# EAGLE schematic MasterPCB_transfer (EAGLE 9.6.2), part 1 of 3

## Sheet 1 of 12: Strain Gauge ADC
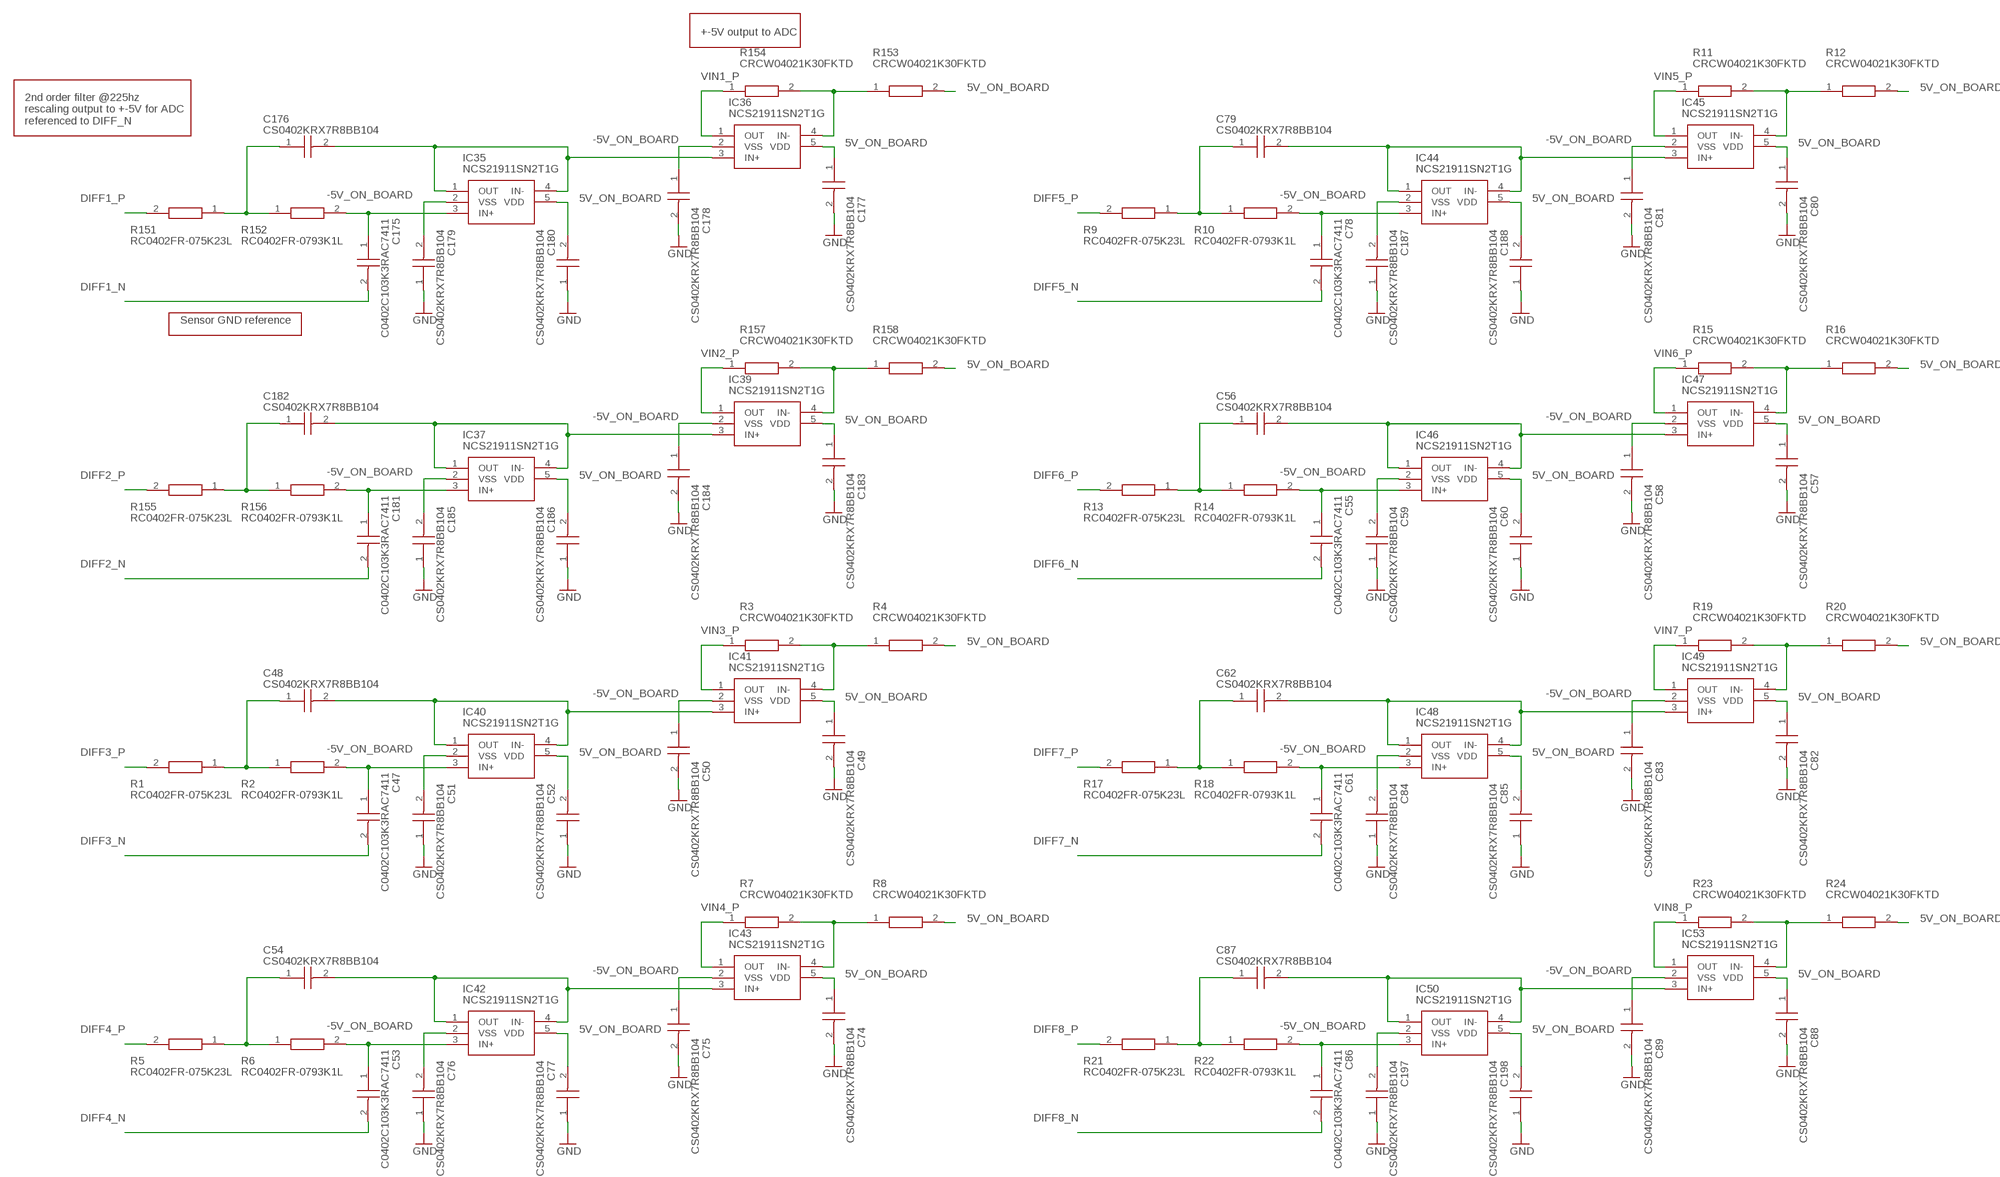
[diagram p0: schematic, sheet 1, part 1 of 3]
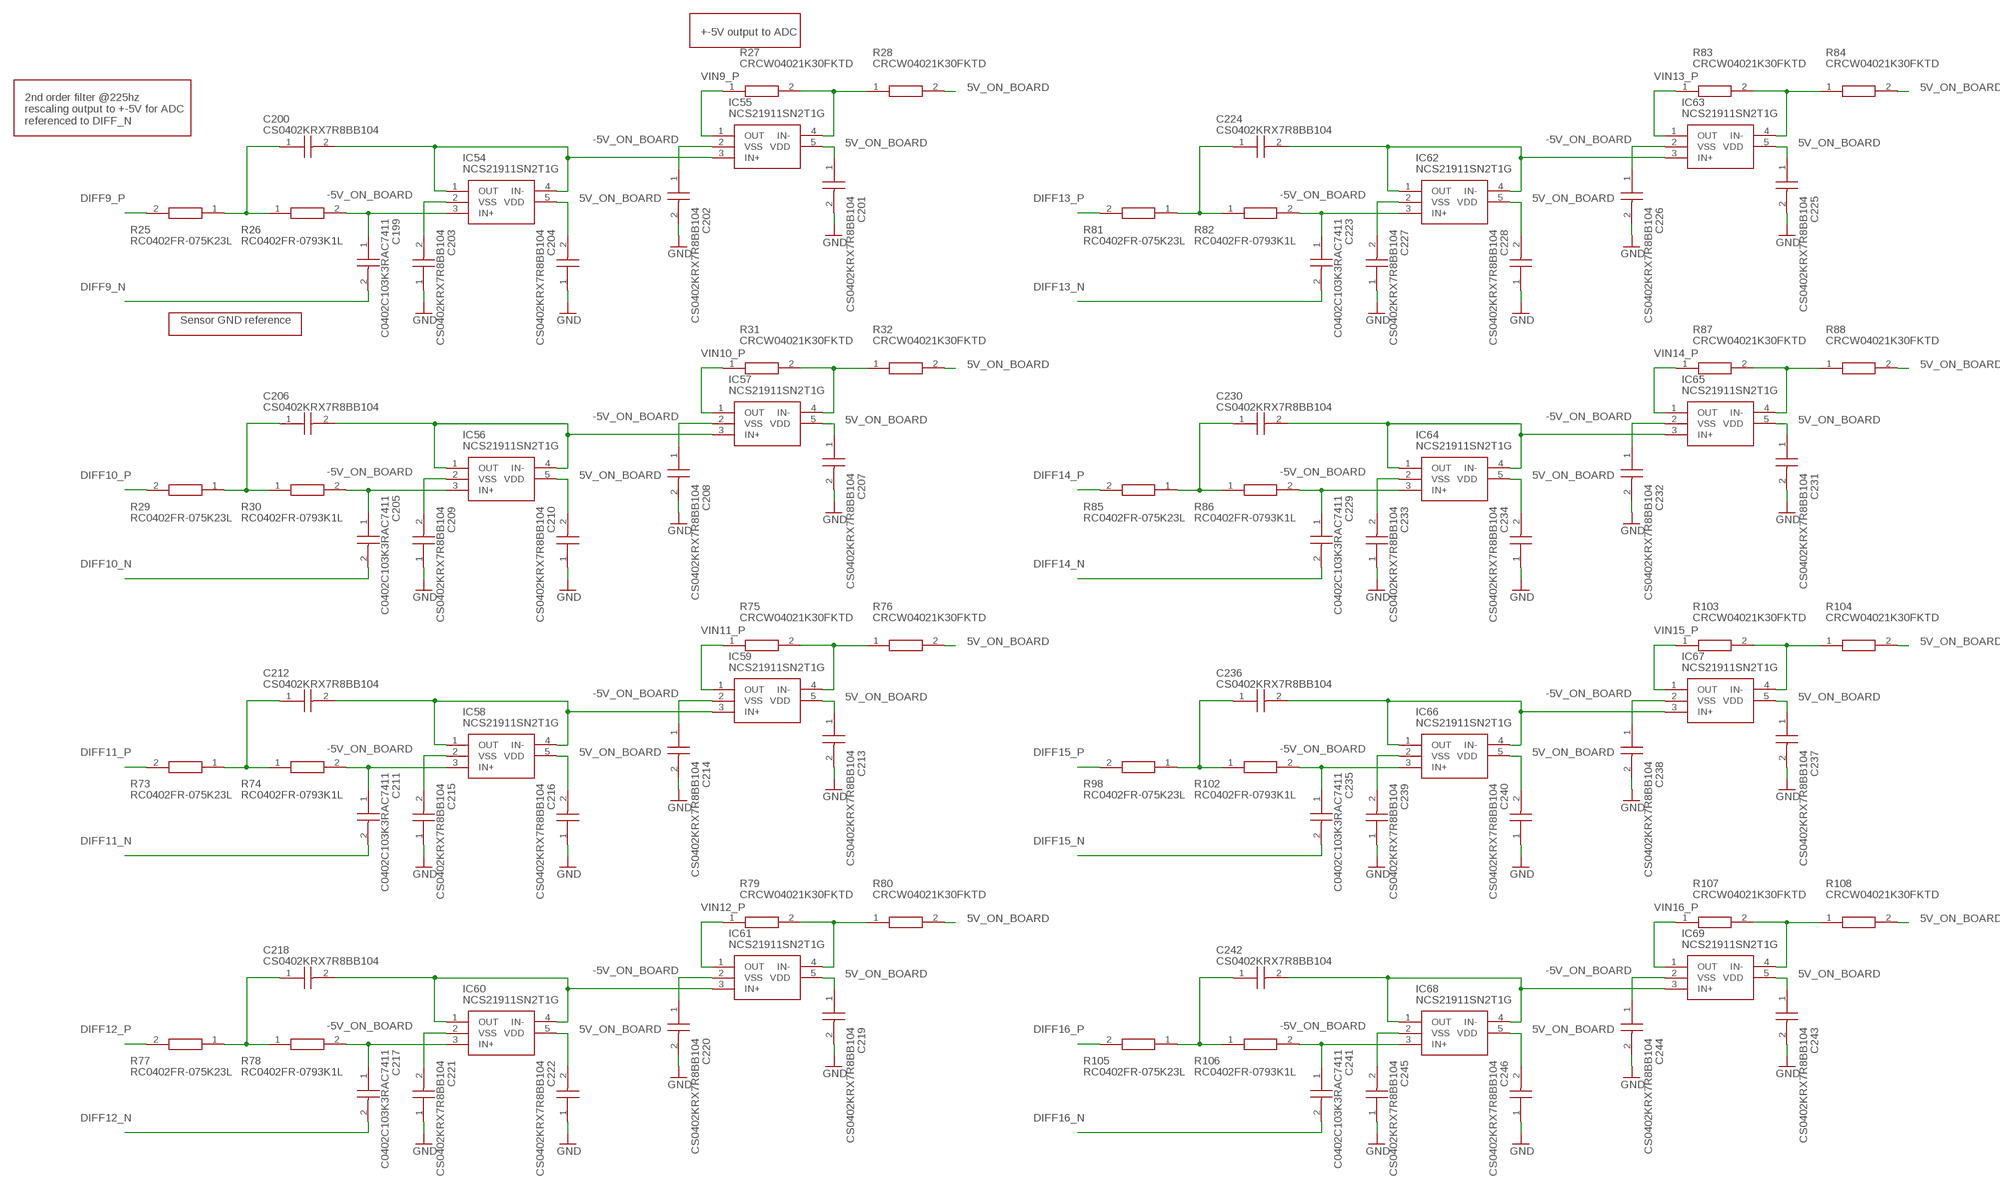
[diagram p1: schematic, sheet 1, part 2 of 3]
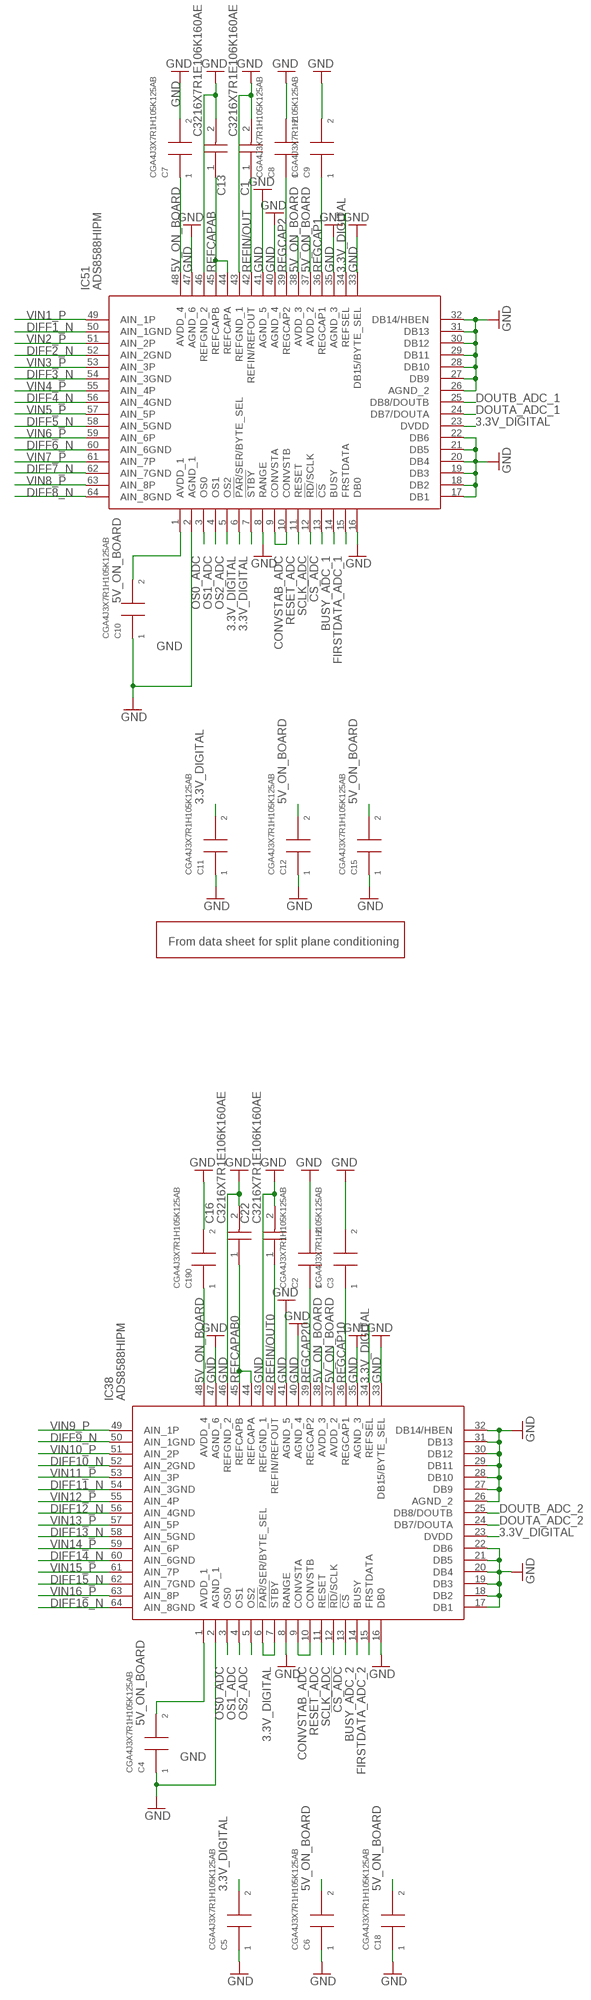
[diagram p2: schematic, sheet 1, part 3 of 3]

### Parts
C1  C3216X7R1E106K160AE  [C3216_COMMERCIAL]
C2  CGA4J3X7R1H105K125AB  [CAPC2012X145N]
C3  CGA4J3X7R1H105K125AB  [CAPC2012X145N]
C4  CGA4J3X7R1H105K125AB  [CAPC2012X145N]
C5  CGA4J3X7R1H105K125AB  [CAPC2012X145N]
C6  CGA4J3X7R1H105K125AB  [CAPC2012X145N]
C7  CGA4J3X7R1H105K125AB  [CAPC2012X145N]
C8  CGA4J3X7R1H105K125AB  [CAPC2012X145N]
C9  CGA4J3X7R1H105K125AB  [CAPC2012X145N]
C10  CGA4J3X7R1H105K125AB  [CAPC2012X145N]
C11  CGA4J3X7R1H105K125AB  [CAPC2012X145N]
C12  CGA4J3X7R1H105K125AB  [CAPC2012X145N]
C13  C3216X7R1E106K160AE  [C3216_COMMERCIAL]
C15  CGA4J3X7R1H105K125AB  [CAPC2012X145N]
C16  C3216X7R1E106K160AE  [C3216_COMMERCIAL]
C18  CGA4J3X7R1H105K125AB  [CAPC2012X145N]
C22  C3216X7R1E106K160AE  [C3216_COMMERCIAL]
C47  C0402C103K3RAC7411  [C0402]
C48  CS0402KRX7R8BB104  [CAPC1005X65N]
C49  CS0402KRX7R8BB104  [CAPC1005X65N]
C50  CS0402KRX7R8BB104  [CAPC1005X65N]
C51  CS0402KRX7R8BB104  [CAPC1005X65N]
C52  CS0402KRX7R8BB104  [CAPC1005X65N]
C53  C0402C103K3RAC7411  [C0402]
C54  CS0402KRX7R8BB104  [CAPC1005X65N]
C55  C0402C103K3RAC7411  [C0402]
C56  CS0402KRX7R8BB104  [CAPC1005X65N]
C57  CS0402KRX7R8BB104  [CAPC1005X65N]
C58  CS0402KRX7R8BB104  [CAPC1005X65N]
C59  CS0402KRX7R8BB104  [CAPC1005X65N]
C60  CS0402KRX7R8BB104  [CAPC1005X65N]
C61  C0402C103K3RAC7411  [C0402]
C62  CS0402KRX7R8BB104  [CAPC1005X65N]
C74  CS0402KRX7R8BB104  [CAPC1005X65N]
C75  CS0402KRX7R8BB104  [CAPC1005X65N]
C76  CS0402KRX7R8BB104  [CAPC1005X65N]
C77  CS0402KRX7R8BB104  [CAPC1005X65N]
C78  C0402C103K3RAC7411  [C0402]
C79  CS0402KRX7R8BB104  [CAPC1005X65N]
C80  CS0402KRX7R8BB104  [CAPC1005X65N]
C81  CS0402KRX7R8BB104  [CAPC1005X65N]
C82  CS0402KRX7R8BB104  [CAPC1005X65N]
C83  CS0402KRX7R8BB104  [CAPC1005X65N]
C84  CS0402KRX7R8BB104  [CAPC1005X65N]
C85  CS0402KRX7R8BB104  [CAPC1005X65N]
C86  C0402C103K3RAC7411  [C0402]
C87  CS0402KRX7R8BB104  [CAPC1005X65N]
C88  CS0402KRX7R8BB104  [CAPC1005X65N]
C89  CS0402KRX7R8BB104  [CAPC1005X65N]
C175  C0402C103K3RAC7411  [C0402]
C176  CS0402KRX7R8BB104  [CAPC1005X65N]
C177  CS0402KRX7R8BB104  [CAPC1005X65N]
C178  CS0402KRX7R8BB104  [CAPC1005X65N]
C179  CS0402KRX7R8BB104  [CAPC1005X65N]
C180  CS0402KRX7R8BB104  [CAPC1005X65N]
C181  C0402C103K3RAC7411  [C0402]
C182  CS0402KRX7R8BB104  [CAPC1005X65N]
C183  CS0402KRX7R8BB104  [CAPC1005X65N]
C184  CS0402KRX7R8BB104  [CAPC1005X65N]
C185  CS0402KRX7R8BB104  [CAPC1005X65N]
C186  CS0402KRX7R8BB104  [CAPC1005X65N]
C187  CS0402KRX7R8BB104  [CAPC1005X65N]
C188  CS0402KRX7R8BB104  [CAPC1005X65N]
C190  CGA4J3X7R1H105K125AB  [CAPC2012X145N]
C197  CS0402KRX7R8BB104  [CAPC1005X65N]
C198  CS0402KRX7R8BB104  [CAPC1005X65N]
C199  C0402C103K3RAC7411  [C0402]
C200  CS0402KRX7R8BB104  [CAPC1005X65N]
C201  CS0402KRX7R8BB104  [CAPC1005X65N]
C202  CS0402KRX7R8BB104  [CAPC1005X65N]
C203  CS0402KRX7R8BB104  [CAPC1005X65N]
C204  CS0402KRX7R8BB104  [CAPC1005X65N]
C205  C0402C103K3RAC7411  [C0402]
C206  CS0402KRX7R8BB104  [CAPC1005X65N]
C207  CS0402KRX7R8BB104  [CAPC1005X65N]
C208  CS0402KRX7R8BB104  [CAPC1005X65N]
C209  CS0402KRX7R8BB104  [CAPC1005X65N]
C210  CS0402KRX7R8BB104  [CAPC1005X65N]
C211  C0402C103K3RAC7411  [C0402]
C212  CS0402KRX7R8BB104  [CAPC1005X65N]
C213  CS0402KRX7R8BB104  [CAPC1005X65N]
C214  CS0402KRX7R8BB104  [CAPC1005X65N]
C215  CS0402KRX7R8BB104  [CAPC1005X65N]
C216  CS0402KRX7R8BB104  [CAPC1005X65N]
C217  C0402C103K3RAC7411  [C0402]
C218  CS0402KRX7R8BB104  [CAPC1005X65N]
C219  CS0402KRX7R8BB104  [CAPC1005X65N]
C220  CS0402KRX7R8BB104  [CAPC1005X65N]
C221  CS0402KRX7R8BB104  [CAPC1005X65N]
C222  CS0402KRX7R8BB104  [CAPC1005X65N]
C223  C0402C103K3RAC7411  [C0402]
C224  CS0402KRX7R8BB104  [CAPC1005X65N]
C225  CS0402KRX7R8BB104  [CAPC1005X65N]
C226  CS0402KRX7R8BB104  [CAPC1005X65N]
C227  CS0402KRX7R8BB104  [CAPC1005X65N]
C228  CS0402KRX7R8BB104  [CAPC1005X65N]
C229  C0402C103K3RAC7411  [C0402]
C230  CS0402KRX7R8BB104  [CAPC1005X65N]
C231  CS0402KRX7R8BB104  [CAPC1005X65N]
C232  CS0402KRX7R8BB104  [CAPC1005X65N]
C233  CS0402KRX7R8BB104  [CAPC1005X65N]
C234  CS0402KRX7R8BB104  [CAPC1005X65N]
C235  C0402C103K3RAC7411  [C0402]
C236  CS0402KRX7R8BB104  [CAPC1005X65N]
C237  CS0402KRX7R8BB104  [CAPC1005X65N]
C238  CS0402KRX7R8BB104  [CAPC1005X65N]
C239  CS0402KRX7R8BB104  [CAPC1005X65N]
C240  CS0402KRX7R8BB104  [CAPC1005X65N]
C241  C0402C103K3RAC7411  [C0402]
C242  CS0402KRX7R8BB104  [CAPC1005X65N]
C243  CS0402KRX7R8BB104  [CAPC1005X65N]
C244  CS0402KRX7R8BB104  [CAPC1005X65N]
C245  CS0402KRX7R8BB104  [CAPC1005X65N]
C246  CS0402KRX7R8BB104  [CAPC1005X65N]
IC35  NCS21911SN2T1G  [SOT95P275X110-5N]
IC36  NCS21911SN2T1G  [SOT95P275X110-5N]
IC37  NCS21911SN2T1G  [SOT95P275X110-5N]
IC38  ADS8588HIPM  [QFP50P1200X1200X160-64N_NO_3D]
IC39  NCS21911SN2T1G  [SOT95P275X110-5N]
IC40  NCS21911SN2T1G  [SOT95P275X110-5N]
IC41  NCS21911SN2T1G  [SOT95P275X110-5N]
IC42  NCS21911SN2T1G  [SOT95P275X110-5N]
IC43  NCS21911SN2T1G  [SOT95P275X110-5N]
IC44  NCS21911SN2T1G  [SOT95P275X110-5N]
IC45  NCS21911SN2T1G  [SOT95P275X110-5N]
IC46  NCS21911SN2T1G  [SOT95P275X110-5N]
IC47  NCS21911SN2T1G  [SOT95P275X110-5N]
IC48  NCS21911SN2T1G  [SOT95P275X110-5N]
IC49  NCS21911SN2T1G  [SOT95P275X110-5N]
IC50  NCS21911SN2T1G  [SOT95P275X110-5N]
IC51  ADS8588HIPM  [QFP50P1200X1200X160-64N_NO_3D]
IC53  NCS21911SN2T1G  [SOT95P275X110-5N]
IC54  NCS21911SN2T1G  [SOT95P275X110-5N]
IC55  NCS21911SN2T1G  [SOT95P275X110-5N]
IC56  NCS21911SN2T1G  [SOT95P275X110-5N]
IC57  NCS21911SN2T1G  [SOT95P275X110-5N]
IC58  NCS21911SN2T1G  [SOT95P275X110-5N]
IC59  NCS21911SN2T1G  [SOT95P275X110-5N]
IC60  NCS21911SN2T1G  [SOT95P275X110-5N]
IC61  NCS21911SN2T1G  [SOT95P275X110-5N]
IC62  NCS21911SN2T1G  [SOT95P275X110-5N]
IC63  NCS21911SN2T1G  [SOT95P275X110-5N]
IC64  NCS21911SN2T1G  [SOT95P275X110-5N]
IC65  NCS21911SN2T1G  [SOT95P275X110-5N]
IC66  NCS21911SN2T1G  [SOT95P275X110-5N]
IC67  NCS21911SN2T1G  [SOT95P275X110-5N]
IC68  NCS21911SN2T1G  [SOT95P275X110-5N]
IC69  NCS21911SN2T1G  [SOT95P275X110-5N]
R1  RC0402FR-075K23L  [RESC1005X40N]
R2  RC0402FR-0793K1L  [RESC1005X40N]
R3  CRCW04021K30FKTD  [RESC1005X40N]
R4  CRCW04021K30FKTD  [RESC1005X40N]
R5  RC0402FR-075K23L  [RESC1005X40N]
R6  RC0402FR-0793K1L  [RESC1005X40N]
R7  CRCW04021K30FKTD  [RESC1005X40N]
R8  CRCW04021K30FKTD  [RESC1005X40N]
R9  RC0402FR-075K23L  [RESC1005X40N]
R10  RC0402FR-0793K1L  [RESC1005X40N]
R11  CRCW04021K30FKTD  [RESC1005X40N]
R12  CRCW04021K30FKTD  [RESC1005X40N]
R13  RC0402FR-075K23L  [RESC1005X40N]
R14  RC0402FR-0793K1L  [RESC1005X40N]
R15  CRCW04021K30FKTD  [RESC1005X40N]
R16  CRCW04021K30FKTD  [RESC1005X40N]
R17  RC0402FR-075K23L  [RESC1005X40N]
R18  RC0402FR-0793K1L  [RESC1005X40N]
R19  CRCW04021K30FKTD  [RESC1005X40N]
R20  CRCW04021K30FKTD  [RESC1005X40N]
R21  RC0402FR-075K23L  [RESC1005X40N]
R22  RC0402FR-0793K1L  [RESC1005X40N]
R23  CRCW04021K30FKTD  [RESC1005X40N]
R24  CRCW04021K30FKTD  [RESC1005X40N]
R25  RC0402FR-075K23L  [RESC1005X40N]
R26  RC0402FR-0793K1L  [RESC1005X40N]
R27  CRCW04021K30FKTD  [RESC1005X40N]
R28  CRCW04021K30FKTD  [RESC1005X40N]
R29  RC0402FR-075K23L  [RESC1005X40N]
R30  RC0402FR-0793K1L  [RESC1005X40N]
R31  CRCW04021K30FKTD  [RESC1005X40N]
R32  CRCW04021K30FKTD  [RESC1005X40N]
R73  RC0402FR-075K23L  [RESC1005X40N]
R74  RC0402FR-0793K1L  [RESC1005X40N]
R75  CRCW04021K30FKTD  [RESC1005X40N]
R76  CRCW04021K30FKTD  [RESC1005X40N]
R77  RC0402FR-075K23L  [RESC1005X40N]
R78  RC0402FR-0793K1L  [RESC1005X40N]
R79  CRCW04021K30FKTD  [RESC1005X40N]
R80  CRCW04021K30FKTD  [RESC1005X40N]
R81  RC0402FR-075K23L  [RESC1005X40N]
R82  RC0402FR-0793K1L  [RESC1005X40N]
R83  CRCW04021K30FKTD  [RESC1005X40N]
R84  CRCW04021K30FKTD  [RESC1005X40N]
R85  RC0402FR-075K23L  [RESC1005X40N]
R86  RC0402FR-0793K1L  [RESC1005X40N]
R87  CRCW04021K30FKTD  [RESC1005X40N]
R88  CRCW04021K30FKTD  [RESC1005X40N]
R98  RC0402FR-075K23L  [RESC1005X40N]
R102  RC0402FR-0793K1L  [RESC1005X40N]
R103  CRCW04021K30FKTD  [RESC1005X40N]
R104  CRCW04021K30FKTD  [RESC1005X40N]
R105  RC0402FR-075K23L  [RESC1005X40N]
R106  RC0402FR-0793K1L  [RESC1005X40N]
R107  CRCW04021K30FKTD  [RESC1005X40N]
R108  CRCW04021K30FKTD  [RESC1005X40N]
R151  RC0402FR-075K23L  [RESC1005X40N]
R152  RC0402FR-0793K1L  [RESC1005X40N]
R153  CRCW04021K30FKTD  [RESC1005X40N]
R154  CRCW04021K30FKTD  [RESC1005X40N]
R155  RC0402FR-075K23L  [RESC1005X40N]
R156  RC0402FR-0793K1L  [RESC1005X40N]
R157  CRCW04021K30FKTD  [RESC1005X40N]
R158  CRCW04021K30FKTD  [RESC1005X40N]

### Nets
3.3V_DIGITAL: C5.2 C11.2 IC38.6(!PAR!/SER/BYTE_SEL) IC38.7(!STBY) IC38.23(DVDD) IC38.34(REFSEL) IC51.6(!PAR!/SER/BYTE_SEL) IC51.7(!STBY) IC51.23(DVDD) IC51.34(REFSEL) ; also sheet 2,4,9,10,11
5V_ON_BOARD: C4.2 C6.2 C7.1 C10.2 C12.2 C15.2 C18.2 C49.1 C52.2 C57.1 C60.2 C74.1 C77.2 C80.1 C82.1 C85.2 C88.1 C177.1 C180.2 C183.1 C186.2 C188.2 C190.1 C198.2 C201.1 C204.2 C207.1 C210.2 C213.1 C216.2 C219.1 C222.2 C225.1 C228.2 C231.1 C234.2 C237.1 C240.2 C243.1 C246.2 IC35.5(VDD) IC36.5(VDD) IC37.5(VDD) IC38.1(AVDD_1) IC38.37(AVDD_2) IC38.38(AVDD_3) IC38.48(AVDD_4) IC39.5(VDD) IC40.5(VDD) IC41.5(VDD) IC42.5(VDD) IC43.5(VDD) IC44.5(VDD) IC45.5(VDD) IC46.5(VDD) IC47.5(VDD) IC48.5(VDD) IC49.5(VDD) IC50.5(VDD) IC51.1(AVDD_1) IC51.37(AVDD_2) IC51.38(AVDD_3) IC51.48(AVDD_4) IC53.5(VDD) IC54.5(VDD) IC55.5(VDD) IC56.5(VDD) IC57.5(VDD) IC58.5(VDD) IC59.5(VDD) IC60.5(VDD) IC61.5(VDD) IC62.5(VDD) IC63.5(VDD) IC64.5(VDD) IC65.5(VDD) IC66.5(VDD) IC67.5(VDD) IC68.5(VDD) IC69.5(VDD) R4.2 R8.2 R12.2 R16.2 R20.2 R24.2 R28.2 R32.2 R76.2 R80.2 R84.2 R88.2 R104.2 R108.2 R153.2 R158.2 ; also sheet 2,4,6
!CS_ADC: IC38.13(!CS) IC51.13(!CS) ; also sheet 2,12
-5V_ON_BOARD: C50.1 C51.2 C58.1 C59.2 C75.1 C76.2 C81.1 C83.1 C84.2 C89.1 C178.1 C179.2 C184.1 C185.2 C187.2 C197.2 C202.1 C203.2 C208.1 C209.2 C214.1 C215.2 C220.1 C221.2 C226.1 C227.2 C232.1 C233.2 C238.1 C239.2 C244.1 C245.2 IC35.2(VSS) IC36.2(VSS) IC37.2(VSS) IC39.2(VSS) IC40.2(VSS) IC41.2(VSS) IC42.2(VSS) IC43.2(VSS) IC44.2(VSS) IC45.2(VSS) IC46.2(VSS) IC47.2(VSS) IC48.2(VSS) IC49.2(VSS) IC50.2(VSS) IC53.2(VSS) IC54.2(VSS) IC55.2(VSS) IC56.2(VSS) IC57.2(VSS) IC58.2(VSS) IC59.2(VSS) IC60.2(VSS) IC61.2(VSS) IC62.2(VSS) IC63.2(VSS) IC64.2(VSS) IC65.2(VSS) IC66.2(VSS) IC67.2(VSS) IC68.2(VSS) IC69.2(VSS) ; also sheet 2,4
BUSY_ADC_1: IC51.14(BUSY) ; also sheet 12
BUSY_ADC_2: IC38.14(BUSY) ; also sheet 12
CONVSTAB_ADC: IC38.9(CONVSTA) IC38.10(CONVSTB) IC51.9(CONVSTA) IC51.10(CONVSTB) ; also sheet 2,12
DIFF1_N: C175.2 IC51.50(AIN_1GND) ; also sheet 11
DIFF1_P: R151.2 ; also sheet 11
DIFF2_N: C181.2 IC51.52(AIN_2GND) ; also sheet 11
DIFF2_P: R155.2 ; also sheet 11
DIFF3_N: C47.2 IC51.54(AIN_3GND) ; also sheet 11
DIFF3_P: R1.2 ; also sheet 11
DIFF4_N: C53.2 IC51.56(AIN_4GND) ; also sheet 11
DIFF4_P: R5.2 ; also sheet 11
DIFF5_N: C78.2 IC51.58(AIN_5GND) ; also sheet 11
DIFF5_P: R9.2 ; also sheet 11
DIFF6_N: C55.2 IC51.60(AIN_6GND) ; also sheet 11
DIFF6_P: R13.2 ; also sheet 11
DIFF7_N: C61.2 IC51.62(AIN_7GND) ; also sheet 11
DIFF7_P: R17.2 ; also sheet 11
DIFF8_N: C86.2 IC51.64(AIN_8GND) ; also sheet 11
DIFF8_P: R21.2 ; also sheet 11
DIFF9_N: C199.2 IC38.50(AIN_1GND) ; also sheet 11
DIFF9_P: R25.2 ; also sheet 11
DIFF10_N: C205.2 IC38.52(AIN_2GND) ; also sheet 11
DIFF10_P: R29.2 ; also sheet 11
DIFF11_N: C211.2 IC38.54(AIN_3GND) ; also sheet 11
DIFF11_P: R73.2 ; also sheet 11
DIFF12_N: C217.2 IC38.56(AIN_4GND) ; also sheet 11
DIFF12_P: R77.2 ; also sheet 11
DIFF13_N: C223.2 IC38.58(AIN_5GND) ; also sheet 11
DIFF13_P: R81.2 ; also sheet 11
DIFF14_N: C229.2 IC38.60(AIN_6GND) ; also sheet 11
DIFF14_P: R85.2 ; also sheet 11
DIFF15_N: C235.2 IC38.62(AIN_7GND) ; also sheet 11
DIFF15_P: R98.2 ; also sheet 11
DIFF16_N: C241.2 IC38.64(AIN_8GND) ; also sheet 11
DIFF16_P: R105.2 ; also sheet 11
DOUTA_ADC_1: IC51.24(DB7/DOUTA) ; also sheet 12
DOUTA_ADC_2: IC38.24(DB7/DOUTA) ; also sheet 12
DOUTB_ADC_1: IC51.25(DB8/DOUTB) ; also sheet 12
DOUTB_ADC_2: IC38.25(DB8/DOUTB) ; also sheet 12
FIRSTDATA_ADC_1: IC51.15(FRSTDATA) ; also sheet 12
FIRSTDATA_ADC_2: IC38.15(FRSTDATA) ; also sheet 12
GND: C1.2 C2.2 C3.2 C4.1 C5.1 C6.1 C7.2 C8.2 C9.2 C10.1 C11.1 C12.1 C13.2 C15.1 C16.2 C18.1 C22.2 C49.2 C50.2 C51.1 C52.1 C57.2 C58.2 C59.1 C60.1 C74.2 C75.2 C76.1 C77.1 C80.2 C81.2 C82.2 C83.2 C84.1 C85.1 C88.2 C89.2 C177.2 C178.2 C179.1 C180.1 C183.2 C184.2 C185.1 C186.1 C187.1 C188.1 C190.2 C197.1 C198.1 C201.2 C202.2 C203.1 C204.1 C207.2 C208.2 C209.1 C210.1 C213.2 C214.2 C215.1 C216.1 C219.2 C220.2 C221.1 C222.1 C225.2 C226.2 C227.1 C228.1 C231.2 C232.2 C233.1 C234.1 C237.2 C238.2 C239.1 C240.1 C243.2 C244.2 C245.1 C246.1 IC38.2(AGND_1) IC38.8(RANGE) IC38.16(DB0) IC38.17(DB1) IC38.18(DB2) IC38.19(DB3) IC38.20(DB4) IC38.21(DB5) IC38.22(DB6) IC38.26(AGND_2) IC38.27(DB9) IC38.28(DB10) IC38.29(DB11) IC38.30(DB12) IC38.31(DB13) IC38.32(DB14/HBEN) IC38.33(DB15/BYTE_SEL) IC38.35(AGND_3) IC38.40(AGND_4) IC38.41(AGND_5) IC38.43(REFGND_1) IC38.46(REFGND_2) IC38.47(AGND_6) IC51.2(AGND_1) IC51.8(RANGE) IC51.16(DB0) IC51.17(DB1) IC51.18(DB2) IC51.19(DB3) IC51.20(DB4) IC51.21(DB5) IC51.22(DB6) IC51.26(AGND_2) IC51.27(DB9) IC51.28(DB10) IC51.29(DB11) IC51.30(DB12) IC51.31(DB13) IC51.32(DB14/HBEN) IC51.33(DB15/BYTE_SEL) IC51.35(AGND_3) IC51.40(AGND_4) IC51.41(AGND_5) IC51.43(REFGND_1) IC51.46(REFGND_2) IC51.47(AGND_6) ; also sheet 2,3,4,5,6,7,8,9,10,11,12
N$6: C48.1 R1.1 R2.1
N$7: C47.1 IC40.3(IN+) R2.2
N$17: IC41.4(IN-) R3.2 R4.1
N$18: C48.2 IC40.1(OUT) IC40.4(IN-) IC41.3(IN+)
N$80: C182.1 R155.1 R156.1
N$86: C54.1 R5.1 R6.1
N$87: C53.1 IC42.3(IN+) R6.2
N$88: IC43.4(IN-) R7.2 R8.1
N$89: C54.2 IC42.1(OUT) IC42.4(IN-) IC43.3(IN+)
N$90: C79.1 R9.1 R10.1
N$91: C78.1 IC44.3(IN+) R10.2
N$92: IC45.4(IN-) R11.2 R12.1
N$93: C79.2 IC44.1(OUT) IC44.4(IN-) IC45.3(IN+)
N$94: C56.1 R13.1 R14.1
N$95: C55.1 IC46.3(IN+) R14.2
N$96: IC47.4(IN-) R15.2 R16.1
N$97: C56.2 IC46.1(OUT) IC46.4(IN-) IC47.3(IN+)
N$98: C62.1 R17.1 R18.1
N$99: C61.1 IC48.3(IN+) R18.2
N$100: IC49.4(IN-) R19.2 R20.1
N$101: C62.2 IC48.1(OUT) IC48.4(IN-) IC49.3(IN+)
N$102: C87.1 R21.1 R22.1
N$103: C86.1 IC50.3(IN+) R22.2
N$104: IC53.4(IN-) R23.2 R24.1
N$105: C87.2 IC50.1(OUT) IC50.4(IN-) IC53.3(IN+)
N$106: C200.1 R25.1 R26.1
N$107: C199.1 IC54.3(IN+) R26.2
N$108: IC55.4(IN-) R27.2 R28.1
N$109: C200.2 IC54.1(OUT) IC54.4(IN-) IC55.3(IN+)
N$110: C206.1 R29.1 R30.1
N$114: C176.2 IC35.1(OUT) IC35.4(IN-) IC36.3(IN+)
N$119: C176.1 R151.1 R152.1
N$130: C175.1 IC35.3(IN+) R152.2
N$132: IC36.4(IN-) R153.1 R154.2
N$133: C181.1 IC37.3(IN+) R156.2
N$136: IC39.4(IN-) R157.2 R158.1
N$139: C182.2 IC37.1(OUT) IC37.4(IN-) IC39.3(IN+)
N$141: C205.1 IC56.3(IN+) R30.2
N$142: IC57.4(IN-) R31.2 R32.1
N$144: C206.2 IC56.1(OUT) IC56.4(IN-) IC57.3(IN+)
N$145: C212.1 R73.1 R74.1
N$166: C211.1 IC58.3(IN+) R74.2
N$170: IC59.4(IN-) R75.2 R76.1
N$171: C212.2 IC58.1(OUT) IC58.4(IN-) IC59.3(IN+)
N$179: C218.1 R77.1 R78.1
N$180: C217.1 IC60.3(IN+) R78.2
N$190: IC61.4(IN-) R79.2 R80.1
N$200: C218.2 IC60.1(OUT) IC60.4(IN-) IC61.3(IN+)
N$210: C224.1 R81.1 R82.1
N$214: C223.1 IC62.3(IN+) R82.2
N$220: IC63.4(IN-) R83.2 R84.1
N$230: C224.2 IC62.1(OUT) IC62.4(IN-) IC63.3(IN+)
N$233: C230.1 R85.1 R86.1
N$234: C229.1 IC64.3(IN+) R86.2
N$240: IC65.4(IN-) R87.2 R88.1
N$249: C230.2 IC64.1(OUT) IC64.4(IN-) IC65.3(IN+)
N$250: C236.1 R98.1 R102.1
N$251: C235.1 IC66.3(IN+) R102.2
N$252: IC67.4(IN-) R103.2 R104.1
N$260: C236.2 IC66.1(OUT) IC66.4(IN-) IC67.3(IN+)
N$267: C242.1 R105.1 R106.1
N$269: C241.1 IC68.3(IN+) R106.2
N$283: IC69.4(IN-) R107.2 R108.1
N$285: C242.2 IC68.1(OUT) IC68.4(IN-) IC69.3(IN+)
OS0_ADC: IC38.3(OS0) IC51.3(OS0) ; also sheet 2,12
OS1_ADC: IC38.4(OS1) IC51.4(OS1) ; also sheet 2,12
OS2_ADC: IC38.5(OS2) IC51.5(OS2) ; also sheet 2,12
REFCAPAB: C13.1 IC51.44(REFCAPA) IC51.45(REFCAPB)
REFCAPAB0: C16.1 IC38.44(REFCAPA) IC38.45(REFCAPB)
REFIN/OUT: C1.1 IC51.42(REFIN/REFOUT)
REFIN/OUT0: C22.1 IC38.42(REFIN/REFOUT)
REGCAP1: C9.1 IC51.36(REGCAP1)
REGCAP2: C8.1 IC51.39(REGCAP2)
REGCAP10: C3.1 IC38.36(REGCAP1)
REGCAP20: C2.1 IC38.39(REGCAP2)
RESET_ADC: IC38.11(RESET) IC51.11(RESET) ; also sheet 2,12
SCLK_ADC: IC38.12(!RD!/SCLK) IC51.12(!RD!/SCLK) ; also sheet 2,12
VIN1_P: IC36.1(OUT) IC51.49(AIN_1P) R154.1
VIN2_P: IC39.1(OUT) IC51.51(AIN_2P) R157.1
VIN3_P: IC41.1(OUT) IC51.53(AIN_3P) R3.1
VIN4_P: IC43.1(OUT) IC51.55(AIN_4P) R7.1
VIN5_P: IC45.1(OUT) IC51.57(AIN_5P) R11.1
VIN6_P: IC47.1(OUT) IC51.59(AIN_6P) R15.1
VIN7_P: IC49.1(OUT) IC51.61(AIN_7P) R19.1
VIN8_P: IC51.63(AIN_8P) IC53.1(OUT) R23.1
VIN9_P: IC38.49(AIN_1P) IC55.1(OUT) R27.1
VIN10_P: IC38.51(AIN_2P) IC57.1(OUT) R31.1
VIN11_P: IC38.53(AIN_3P) IC59.1(OUT) R75.1
VIN12_P: IC38.55(AIN_4P) IC61.1(OUT) R79.1
VIN13_P: IC38.57(AIN_5P) IC63.1(OUT) R83.1
VIN14_P: IC38.59(AIN_6P) IC65.1(OUT) R87.1
VIN15_P: IC38.61(AIN_7P) IC67.1(OUT) R103.1
VIN16_P: IC38.63(AIN_8P) IC69.1(OUT) R107.1

### Notes on the sheet
- +-5V output to ADC
- 2nd order filter @225hz
  rescaling output to +-5V for ADC
  referenced to DIFF_N
- Sensor GND reference
- +-5V output to ADC
- From data sheet for split plane conditioning
- 2nd order filter @225hz
  rescaling output to +-5V for ADC
  referenced to DIFF_N
- Sensor GND reference

## Sheet 2 of 12: General and accelerometer ADC
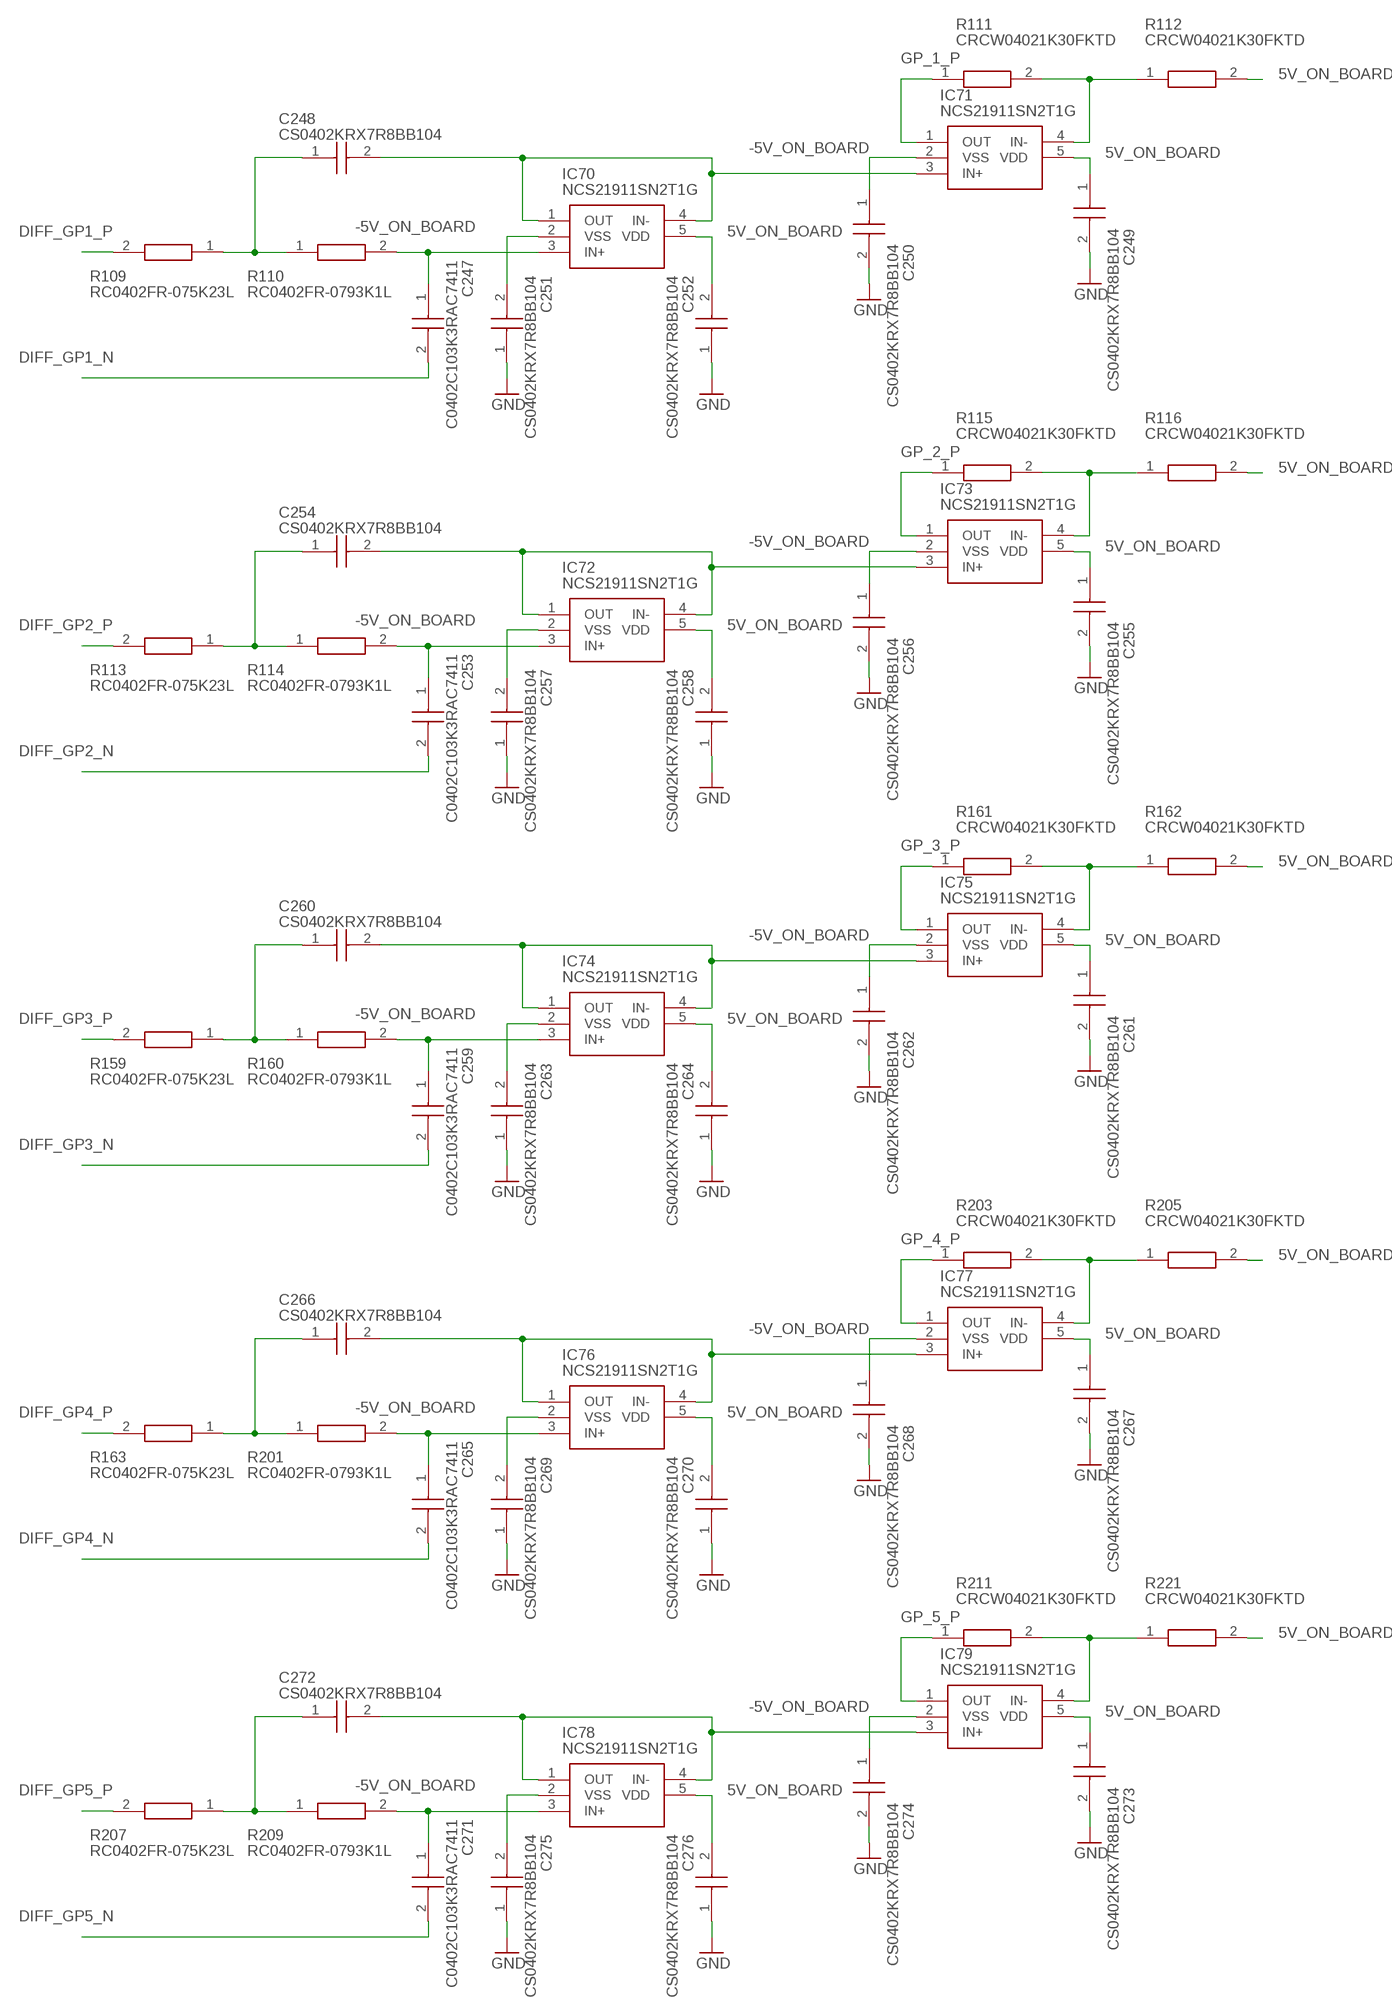
[diagram p3: schematic, sheet 2, part 1 of 2]
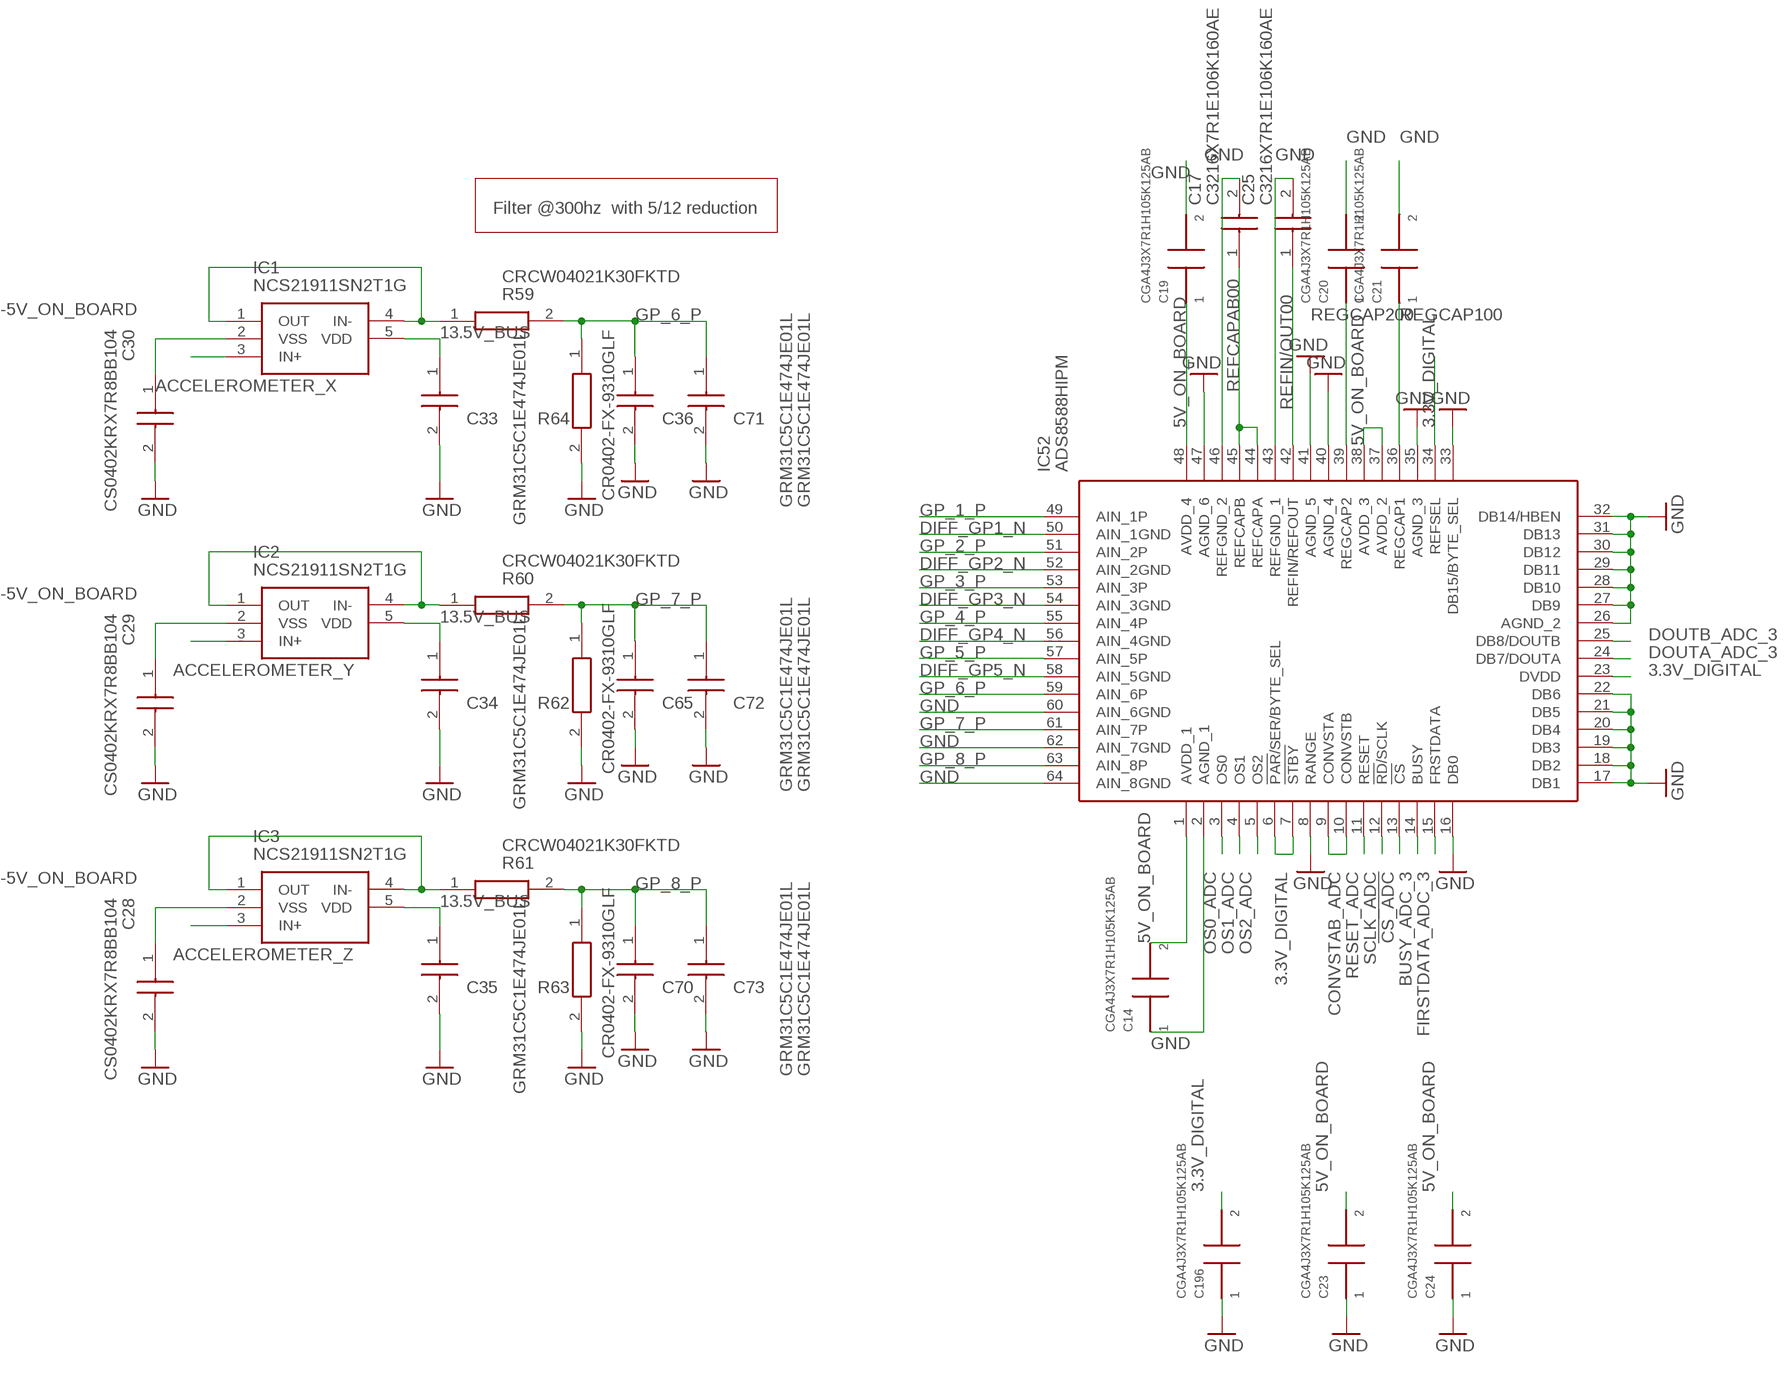
[diagram p4: schematic, sheet 2, part 2 of 2]

### Parts
C14  CGA4J3X7R1H105K125AB  [CAPC2012X145N]
C17  C3216X7R1E106K160AE  [C3216_COMMERCIAL]
C19  CGA4J3X7R1H105K125AB  [CAPC2012X145N]
C20  CGA4J3X7R1H105K125AB  [CAPC2012X145N]
C21  CGA4J3X7R1H105K125AB  [CAPC2012X145N]
C23  CGA4J3X7R1H105K125AB  [CAPC2012X145N]
C24  CGA4J3X7R1H105K125AB  [CAPC2012X145N]
C25  C3216X7R1E106K160AE  [C3216_COMMERCIAL]
C28  CS0402KRX7R8BB104  [CAPC1005X65N]
C29  CS0402KRX7R8BB104  [CAPC1005X65N]
C30  CS0402KRX7R8BB104  [CAPC1005X65N]
C33  GRM31C5C1E474JE01L  [CAPC3216X180N]
C34  GRM31C5C1E474JE01L  [CAPC3216X180N]
C35  GRM31C5C1E474JE01L  [CAPC3216X180N]
C36  GRM31C5C1E474JE01L  [CAPC3216X180N]
C65  GRM31C5C1E474JE01L  [CAPC3216X180N]
C70  GRM31C5C1E474JE01L  [CAPC3216X180N]
C71  GRM31C5C1E474JE01L  [CAPC3216X180N]
C72  GRM31C5C1E474JE01L  [CAPC3216X180N]
C73  GRM31C5C1E474JE01L  [CAPC3216X180N]
C196  CGA4J3X7R1H105K125AB  [CAPC2012X145N]
C247  C0402C103K3RAC7411  [C0402]
C248  CS0402KRX7R8BB104  [CAPC1005X65N]
C249  CS0402KRX7R8BB104  [CAPC1005X65N]
C250  CS0402KRX7R8BB104  [CAPC1005X65N]
C251  CS0402KRX7R8BB104  [CAPC1005X65N]
C252  CS0402KRX7R8BB104  [CAPC1005X65N]
C253  C0402C103K3RAC7411  [C0402]
C254  CS0402KRX7R8BB104  [CAPC1005X65N]
C255  CS0402KRX7R8BB104  [CAPC1005X65N]
C256  CS0402KRX7R8BB104  [CAPC1005X65N]
C257  CS0402KRX7R8BB104  [CAPC1005X65N]
C258  CS0402KRX7R8BB104  [CAPC1005X65N]
C259  C0402C103K3RAC7411  [C0402]
C260  CS0402KRX7R8BB104  [CAPC1005X65N]
C261  CS0402KRX7R8BB104  [CAPC1005X65N]
C262  CS0402KRX7R8BB104  [CAPC1005X65N]
C263  CS0402KRX7R8BB104  [CAPC1005X65N]
C264  CS0402KRX7R8BB104  [CAPC1005X65N]
C265  C0402C103K3RAC7411  [C0402]
C266  CS0402KRX7R8BB104  [CAPC1005X65N]
C267  CS0402KRX7R8BB104  [CAPC1005X65N]
C268  CS0402KRX7R8BB104  [CAPC1005X65N]
C269  CS0402KRX7R8BB104  [CAPC1005X65N]
C270  CS0402KRX7R8BB104  [CAPC1005X65N]
C271  C0402C103K3RAC7411  [C0402]
C272  CS0402KRX7R8BB104  [CAPC1005X65N]
C273  CS0402KRX7R8BB104  [CAPC1005X65N]
C274  CS0402KRX7R8BB104  [CAPC1005X65N]
C275  CS0402KRX7R8BB104  [CAPC1005X65N]
C276  CS0402KRX7R8BB104  [CAPC1005X65N]
IC1  NCS21911SN2T1G  [SOT95P275X110-5N]
IC2  NCS21911SN2T1G  [SOT95P275X110-5N]
IC3  NCS21911SN2T1G  [SOT95P275X110-5N]
IC52  ADS8588HIPM  [QFP50P1200X1200X160-64N_NO_3D]
IC70  NCS21911SN2T1G  [SOT95P275X110-5N]
IC71  NCS21911SN2T1G  [SOT95P275X110-5N]
IC72  NCS21911SN2T1G  [SOT95P275X110-5N]
IC73  NCS21911SN2T1G  [SOT95P275X110-5N]
IC74  NCS21911SN2T1G  [SOT95P275X110-5N]
IC75  NCS21911SN2T1G  [SOT95P275X110-5N]
IC76  NCS21911SN2T1G  [SOT95P275X110-5N]
IC77  NCS21911SN2T1G  [SOT95P275X110-5N]
IC78  NCS21911SN2T1G  [SOT95P275X110-5N]
IC79  NCS21911SN2T1G  [SOT95P275X110-5N]
R59  CRCW04021K30FKTD  [RESC1005X40N]
R60  CRCW04021K30FKTD  [RESC1005X40N]
R61  CRCW04021K30FKTD  [RESC1005X40N]
R62  CR0402-FX-9310GLF  [RESC1005X40N]
R63  CR0402-FX-9310GLF  [RESC1005X40N]
R64  CR0402-FX-9310GLF  [RESC1005X40N]
R109  RC0402FR-075K23L  [RESC1005X40N]
R110  RC0402FR-0793K1L  [RESC1005X40N]
R111  CRCW04021K30FKTD  [RESC1005X40N]
R112  CRCW04021K30FKTD  [RESC1005X40N]
R113  RC0402FR-075K23L  [RESC1005X40N]
R114  RC0402FR-0793K1L  [RESC1005X40N]
R115  CRCW04021K30FKTD  [RESC1005X40N]
R116  CRCW04021K30FKTD  [RESC1005X40N]
R159  RC0402FR-075K23L  [RESC1005X40N]
R160  RC0402FR-0793K1L  [RESC1005X40N]
R161  CRCW04021K30FKTD  [RESC1005X40N]
R162  CRCW04021K30FKTD  [RESC1005X40N]
R163  RC0402FR-075K23L  [RESC1005X40N]
R201  RC0402FR-0793K1L  [RESC1005X40N]
R203  CRCW04021K30FKTD  [RESC1005X40N]
R205  CRCW04021K30FKTD  [RESC1005X40N]
R207  RC0402FR-075K23L  [RESC1005X40N]
R209  RC0402FR-0793K1L  [RESC1005X40N]
R211  CRCW04021K30FKTD  [RESC1005X40N]
R221  CRCW04021K30FKTD  [RESC1005X40N]

### Nets
3.3V_DIGITAL: C196.2 IC52.6(!PAR!/SER/BYTE_SEL) IC52.7(!STBY) IC52.23(DVDD) IC52.34(REFSEL) ; also sheet 1,4,9,10,11
5V_ON_BOARD: C14.2 C19.1 C23.2 C24.2 C249.1 C252.2 C255.1 C258.2 C261.1 C264.2 C267.1 C270.2 C273.1 C276.2 IC52.1(AVDD_1) IC52.37(AVDD_2) IC52.38(AVDD_3) IC52.48(AVDD_4) IC70.5(VDD) IC71.5(VDD) IC72.5(VDD) IC73.5(VDD) IC74.5(VDD) IC75.5(VDD) IC76.5(VDD) IC77.5(VDD) IC78.5(VDD) IC79.5(VDD) R112.2 R116.2 R162.2 R205.2 R221.2 ; also sheet 1,4,6
13.5V_BUS: C33.1 C34.1 C35.1 IC1.5(VDD) IC2.5(VDD) IC3.5(VDD) ; also sheet 4,5,6,11,12
!CS_ADC: IC52.13(!CS) ; also sheet 1,12
-5V_ON_BOARD: C28.1 C29.1 C30.1 C250.1 C251.2 C256.1 C257.2 C262.1 C263.2 C268.1 C269.2 C274.1 C275.2 IC1.2(VSS) IC2.2(VSS) IC3.2(VSS) IC70.2(VSS) IC71.2(VSS) IC72.2(VSS) IC73.2(VSS) IC74.2(VSS) IC75.2(VSS) IC76.2(VSS) IC77.2(VSS) IC78.2(VSS) IC79.2(VSS) ; also sheet 1,4
ACCELEROMETER_X: IC1.3(IN+) ; also sheet 11
ACCELEROMETER_Y: IC2.3(IN+) ; also sheet 11
ACCELEROMETER_Z: IC3.3(IN+) ; also sheet 11
BUSY_ADC_3: IC52.14(BUSY) ; also sheet 12
CONVSTAB_ADC: IC52.9(CONVSTA) IC52.10(CONVSTB) ; also sheet 1,12
DIFF_GP1_N: C247.2 IC52.50(AIN_1GND) ; also sheet 11
DIFF_GP1_P: R109.2 ; also sheet 11
DIFF_GP2_N: C253.2 IC52.52(AIN_2GND) ; also sheet 11
DIFF_GP2_P: R113.2 ; also sheet 11
DIFF_GP3_N: C259.2 IC52.54(AIN_3GND) ; also sheet 11
DIFF_GP3_P: R159.2 ; also sheet 11
DIFF_GP4_N: C265.2 IC52.56(AIN_4GND) ; also sheet 11
DIFF_GP4_P: R163.2 ; also sheet 11
DIFF_GP5_N: C271.2 IC52.58(AIN_5GND) ; also sheet 11
DIFF_GP5_P: R207.2 ; also sheet 11
DOUTA_ADC_3: IC52.24(DB7/DOUTA) ; also sheet 12
DOUTB_ADC_3: IC52.25(DB8/DOUTB) ; also sheet 12
FIRSTDATA_ADC_3: IC52.15(FRSTDATA) ; also sheet 12
GND: C14.1 C17.2 C19.2 C20.2 C21.2 C23.1 C24.1 C25.2 C28.2 C29.2 C30.2 C33.2 C34.2 C35.2 C36.2 C65.2 C70.2 C71.2 C72.2 C73.2 C196.1 C249.2 C250.2 C251.1 C252.1 C255.2 C256.2 C257.1 C258.1 C261.2 C262.2 C263.1 C264.1 C267.2 C268.2 C269.1 C270.1 C273.2 C274.2 C275.1 C276.1 IC52.2(AGND_1) IC52.8(RANGE) IC52.16(DB0) IC52.17(DB1) IC52.18(DB2) IC52.19(DB3) IC52.20(DB4) IC52.21(DB5) IC52.22(DB6) IC52.26(AGND_2) IC52.27(DB9) IC52.28(DB10) IC52.29(DB11) IC52.30(DB12) IC52.31(DB13) IC52.32(DB14/HBEN) IC52.33(DB15/BYTE_SEL) IC52.35(AGND_3) IC52.40(AGND_4) IC52.41(AGND_5) IC52.43(REFGND_1) IC52.46(REFGND_2) IC52.47(AGND_6) IC52.60(AIN_6GND) IC52.62(AIN_7GND) IC52.64(AIN_8GND) R62.2 R63.2 R64.2 ; also sheet 1,3,4,5,6,7,8,9,10,11,12
GP_1_P: IC52.49(AIN_1P) IC71.1(OUT) R111.1
GP_2_P: IC52.51(AIN_2P) IC73.1(OUT) R115.1
GP_3_P: IC52.53(AIN_3P) IC75.1(OUT) R161.1
GP_4_P: IC52.55(AIN_4P) IC77.1(OUT) R203.1
GP_5_P: IC52.57(AIN_5P) IC79.1(OUT) R211.1
GP_6_P: C36.1 C71.1 IC52.59(AIN_6P) R59.2 R64.1
GP_7_P: C65.1 C72.1 IC52.61(AIN_7P) R60.2 R62.1
GP_8_P: C70.1 C73.1 IC52.63(AIN_8P) R61.2 R63.1
N$52: IC1.1(OUT) IC1.4(IN-) R59.1
N$53: IC3.1(OUT) IC3.4(IN-) R61.1
N$54: IC2.1(OUT) IC2.4(IN-) R60.1
N$299: C248.1 R109.1 R110.1
N$300: C247.1 IC70.3(IN+) R110.2
N$315: IC71.4(IN-) R111.2 R112.1
N$316: C248.2 IC70.1(OUT) IC70.4(IN-) IC71.3(IN+)
N$349: C254.1 R113.1 R114.1
N$351: C253.1 IC72.3(IN+) R114.2
N$352: IC73.4(IN-) R115.2 R116.1
N$353: C254.2 IC72.1(OUT) IC72.4(IN-) IC73.3(IN+)
N$354: C260.1 R159.1 R160.1
N$355: C259.1 IC74.3(IN+) R160.2
N$357: IC75.4(IN-) R161.2 R162.1
N$358: C260.2 IC74.1(OUT) IC74.4(IN-) IC75.3(IN+)
N$359: C266.1 R163.1 R201.1
N$361: C265.1 IC76.3(IN+) R201.2
N$362: IC77.4(IN-) R203.2 R205.1
N$363: C266.2 IC76.1(OUT) IC76.4(IN-) IC77.3(IN+)
N$364: C272.1 R207.1 R209.1
N$367: C271.1 IC78.3(IN+) R209.2
N$368: IC79.4(IN-) R211.2 R221.1
N$371: C272.2 IC78.1(OUT) IC78.4(IN-) IC79.3(IN+)
OS0_ADC: IC52.3(OS0) ; also sheet 1,12
OS1_ADC: IC52.4(OS1) ; also sheet 1,12
OS2_ADC: IC52.5(OS2) ; also sheet 1,12
REFCAPAB00: C17.1 IC52.44(REFCAPA) IC52.45(REFCAPB)
REFIN/OUT00: C25.1 IC52.42(REFIN/REFOUT)
REGCAP100: C21.1 IC52.36(REGCAP1)
REGCAP200: C20.1 IC52.39(REGCAP2)
RESET_ADC: IC52.11(RESET) ; also sheet 1,12
SCLK_ADC: IC52.12(!RD!/SCLK) ; also sheet 1,12

### Notes on the sheet
- Filter @300hz  with 5/12 reduction

## Sheet 3 of 12: Digital Logic Input
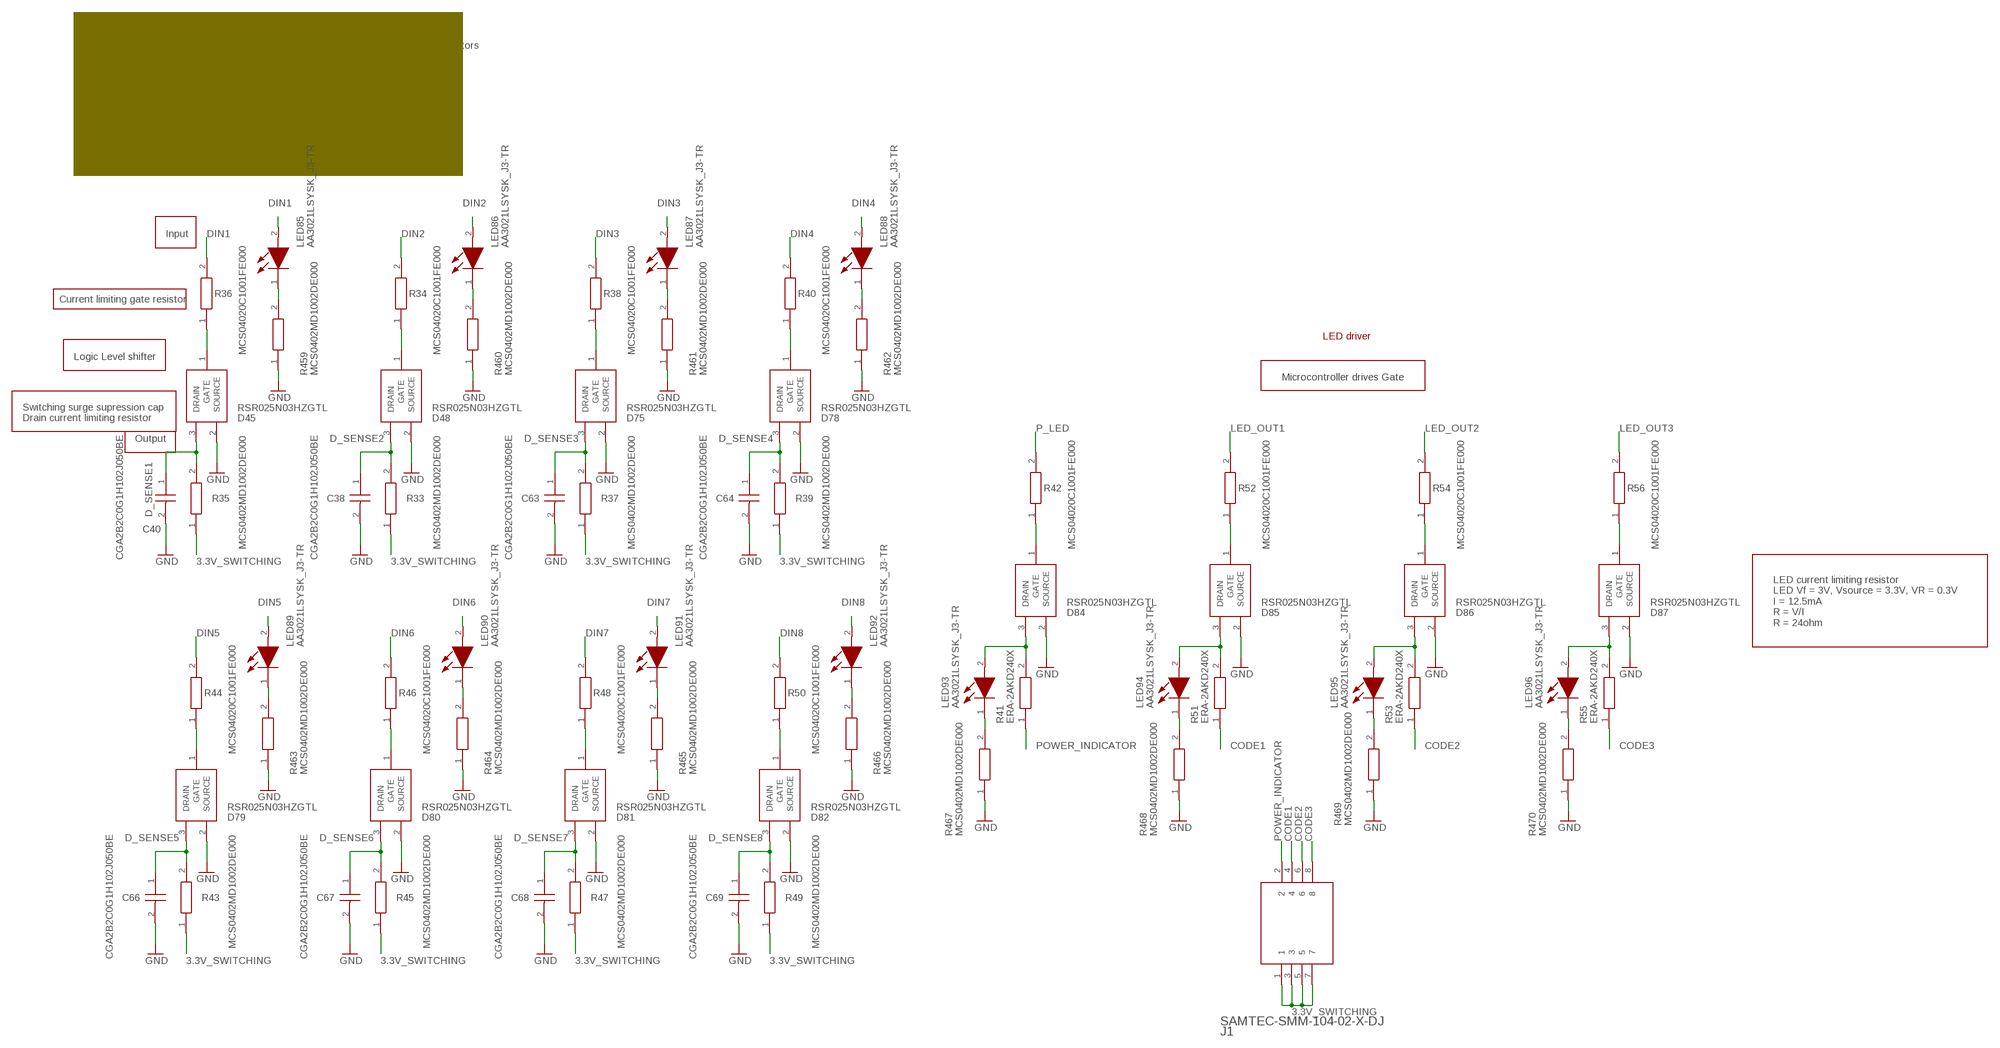
[diagram p5: schematic, sheet 3]

### Parts
C38  CGA2B2C0G1H102J050BE  [CAPC1005X55N]
C40  CGA2B2C0G1H102J050BE  [CAPC1005X55N]
C63  CGA2B2C0G1H102J050BE  [CAPC1005X55N]
C64  CGA2B2C0G1H102J050BE  [CAPC1005X55N]
C66  CGA2B2C0G1H102J050BE  [CAPC1005X55N]
C67  CGA2B2C0G1H102J050BE  [CAPC1005X55N]
C68  CGA2B2C0G1H102J050BE  [CAPC1005X55N]
C69  CGA2B2C0G1H102J050BE  [CAPC1005X55N]
D45  RSR025N03HZGTL  [SOT95P280X100-3N]
D48  RSR025N03HZGTL  [SOT95P280X100-3N]
D75  RSR025N03HZGTL  [SOT95P280X100-3N]
D78  RSR025N03HZGTL  [SOT95P280X100-3N]
D79  RSR025N03HZGTL  [SOT95P280X100-3N]
D80  RSR025N03HZGTL  [SOT95P280X100-3N]
D81  RSR025N03HZGTL  [SOT95P280X100-3N]
D82  RSR025N03HZGTL  [SOT95P280X100-3N]
D84  RSR025N03HZGTL  [SOT95P280X100-3N]
D85  RSR025N03HZGTL  [SOT95P280X100-3N]
D86  RSR025N03HZGTL  [SOT95P280X100-3N]
D87  RSR025N03HZGTL  [SOT95P280X100-3N]
J1  SAMTEC-SMM-104-02-X-DJ  [SAMTEC-SMM-104-02-X-D]
LED85  AA3021LSYSK_J3-TR  [AA3021LSYSKJ3TR]
LED86  AA3021LSYSK_J3-TR  [AA3021LSYSKJ3TR]
LED87  AA3021LSYSK_J3-TR  [AA3021LSYSKJ3TR]
LED88  AA3021LSYSK_J3-TR  [AA3021LSYSKJ3TR]
LED89  AA3021LSYSK_J3-TR  [AA3021LSYSKJ3TR]
LED90  AA3021LSYSK_J3-TR  [AA3021LSYSKJ3TR]
LED91  AA3021LSYSK_J3-TR  [AA3021LSYSKJ3TR]
LED92  AA3021LSYSK_J3-TR  [AA3021LSYSKJ3TR]
LED93  AA3021LSYSK_J3-TR  [AA3021LSYSKJ3TR]
LED94  AA3021LSYSK_J3-TR  [AA3021LSYSKJ3TR]
LED95  AA3021LSYSK_J3-TR  [AA3021LSYSKJ3TR]
LED96  AA3021LSYSK_J3-TR  [AA3021LSYSKJ3TR]
R33  MCS0402MD1002DE000  [RESC1005X37N]
R34  MCS04020C1001FE000  [RESC1005X37N]
R35  MCS0402MD1002DE000  [RESC1005X37N]
R36  MCS04020C1001FE000  [RESC1005X37N]
R37  MCS0402MD1002DE000  [RESC1005X37N]
R38  MCS04020C1001FE000  [RESC1005X37N]
R39  MCS0402MD1002DE000  [RESC1005X37N]
R40  MCS04020C1001FE000  [RESC1005X37N]
R41  ERA-2AKD240X  [ERA2A_(0402)]
R42  MCS04020C1001FE000  [RESC1005X37N]
R43  MCS0402MD1002DE000  [RESC1005X37N]
R44  MCS04020C1001FE000  [RESC1005X37N]
R45  MCS0402MD1002DE000  [RESC1005X37N]
R46  MCS04020C1001FE000  [RESC1005X37N]
R47  MCS0402MD1002DE000  [RESC1005X37N]
R48  MCS04020C1001FE000  [RESC1005X37N]
R49  MCS0402MD1002DE000  [RESC1005X37N]
R50  MCS04020C1001FE000  [RESC1005X37N]
R51  ERA-2AKD240X  [ERA2A_(0402)]
R52  MCS04020C1001FE000  [RESC1005X37N]
R53  ERA-2AKD240X  [ERA2A_(0402)]
R54  MCS04020C1001FE000  [RESC1005X37N]
R55  ERA-2AKD240X  [ERA2A_(0402)]
R56  MCS04020C1001FE000  [RESC1005X37N]
R459  MCS0402MD1002DE000  [RESC1005X37N]
R460  MCS0402MD1002DE000  [RESC1005X37N]
R461  MCS0402MD1002DE000  [RESC1005X37N]
R462  MCS0402MD1002DE000  [RESC1005X37N]
R463  MCS0402MD1002DE000  [RESC1005X37N]
R464  MCS0402MD1002DE000  [RESC1005X37N]
R465  MCS0402MD1002DE000  [RESC1005X37N]
R466  MCS0402MD1002DE000  [RESC1005X37N]
R467  MCS0402MD1002DE000  [RESC1005X37N]
R468  MCS0402MD1002DE000  [RESC1005X37N]
R469  MCS0402MD1002DE000  [RESC1005X37N]
R470  MCS0402MD1002DE000  [RESC1005X37N]

### Nets
3.3V_SWITCHING: J1.1 J1.3 J1.5 J1.7 R33.1 R35.1 R37.1 R39.1 R43.1 R45.1 R47.1 R49.1 ; also sheet 4,12
CODE1: J1.4 R51.1
CODE2: J1.6 R53.1
CODE3: J1.8 R55.1
D_SENSE1: C40.1 D45.3(DRAIN) R35.2 ; also sheet 12
D_SENSE2: C38.1 D48.3(DRAIN) R33.2 ; also sheet 12
D_SENSE3: C63.1 D75.3(DRAIN) R37.2 ; also sheet 12
D_SENSE4: C64.1 D78.3(DRAIN) R39.2 ; also sheet 12
D_SENSE5: C66.1 D79.3(DRAIN) R43.2 ; also sheet 12
D_SENSE6: C67.1 D80.3(DRAIN) R45.2 ; also sheet 12
D_SENSE7: C68.1 D81.3(DRAIN) R47.2 ; also sheet 12
D_SENSE8: C69.1 D82.3(DRAIN) R49.2 ; also sheet 12
DIN1: LED85.2(A) R36.2 ; also sheet 11
DIN2: LED86.2(A) R34.2 ; also sheet 11
DIN3: LED87.2(A) R38.2 ; also sheet 11
DIN4: LED88.2(A) R40.2 ; also sheet 11
DIN5: LED89.2(A) R44.2 ; also sheet 11
DIN6: LED90.2(A) R46.2 ; also sheet 11
DIN7: LED91.2(A) R48.2 ; also sheet 11
DIN8: LED92.2(A) R50.2 ; also sheet 11
GND: C38.2 C40.2 C63.2 C64.2 C66.2 C67.2 C68.2 C69.2 D45.2(SOURCE) D48.2(SOURCE) D75.2(SOURCE) D78.2(SOURCE) D79.2(SOURCE) D80.2(SOURCE) D81.2(SOURCE) D82.2(SOURCE) D84.2(SOURCE) D85.2(SOURCE) D86.2(SOURCE) D87.2(SOURCE) R459.1 R460.1 R461.1 R462.1 R463.1 R464.1 R465.1 R466.1 R467.1 R468.1 R469.1 R470.1 ; also sheet 1,2,4,5,6,7,8,9,10,11,12
LED_OUT1: R52.2 ; also sheet 12
LED_OUT2: R54.2 ; also sheet 12
LED_OUT3: R56.2 ; also sheet 12
N$19: D48.1(GATE) R34.1
N$22: D45.1(GATE) R36.1
N$112: D84.3(DRAIN) LED93.2(A) R41.2
N$113: D84.1(GATE) R42.1
N$116: D75.1(GATE) R38.1
N$118: D85.3(DRAIN) LED94.2(A) R51.2
N$120: D78.1(GATE) R40.1
N$122: D85.1(GATE) R52.1
N$128: D86.3(DRAIN) LED95.2(A) R53.2
N$131: D86.1(GATE) R54.1
N$135: D87.3(DRAIN) LED96.2(A) R55.2
N$137: D79.1(GATE) R44.1
N$138: D87.1(GATE) R56.1
N$140: D80.1(GATE) R46.1
N$143: D81.1(GATE) R48.1
N$146: D82.1(GATE) R50.1
N$336: LED85.1(K) R459.2
N$337: LED86.1(K) R460.2
N$338: LED93.1(K) R467.2
N$339: LED94.1(K) R468.2
N$340: LED87.1(K) R461.2
N$341: LED95.1(K) R469.2
N$342: LED88.1(K) R462.2
N$343: LED96.1(K) R470.2
N$344: LED89.1(K) R463.2
N$346: LED90.1(K) R464.2
N$348: LED91.1(K) R465.2
N$350: LED92.1(K) R466.2
P_LED: R42.2 ; also sheet 12
POWER_INDICATOR: J1.2 R41.1

### Notes on the sheet
- This section is for taking in any digital input voltage from hall effects, status indicators
  or any sensor with spurious outputs that are not communication
  based.
  
  Input to opto isolator has an inline resistor for current limiting and
  a pull down resistor.
  
  Output would be directly connected to microcontroller and
  a pull down resistor.
- Input
- Current limiting gate resistor
- LED driver
- Logic Level shifter
- Microcontroller drives Gate
- Switching surge supression cap
  Drain current limiting resistor
- Output
- LED current limiting resistor
  LED Vf = 3V, Vsource = 3.3V, VR = 0.3V
  I = 12.5mA
  R = V/I
  R = 24ohm

## Sheet 4 of 12: Power rails
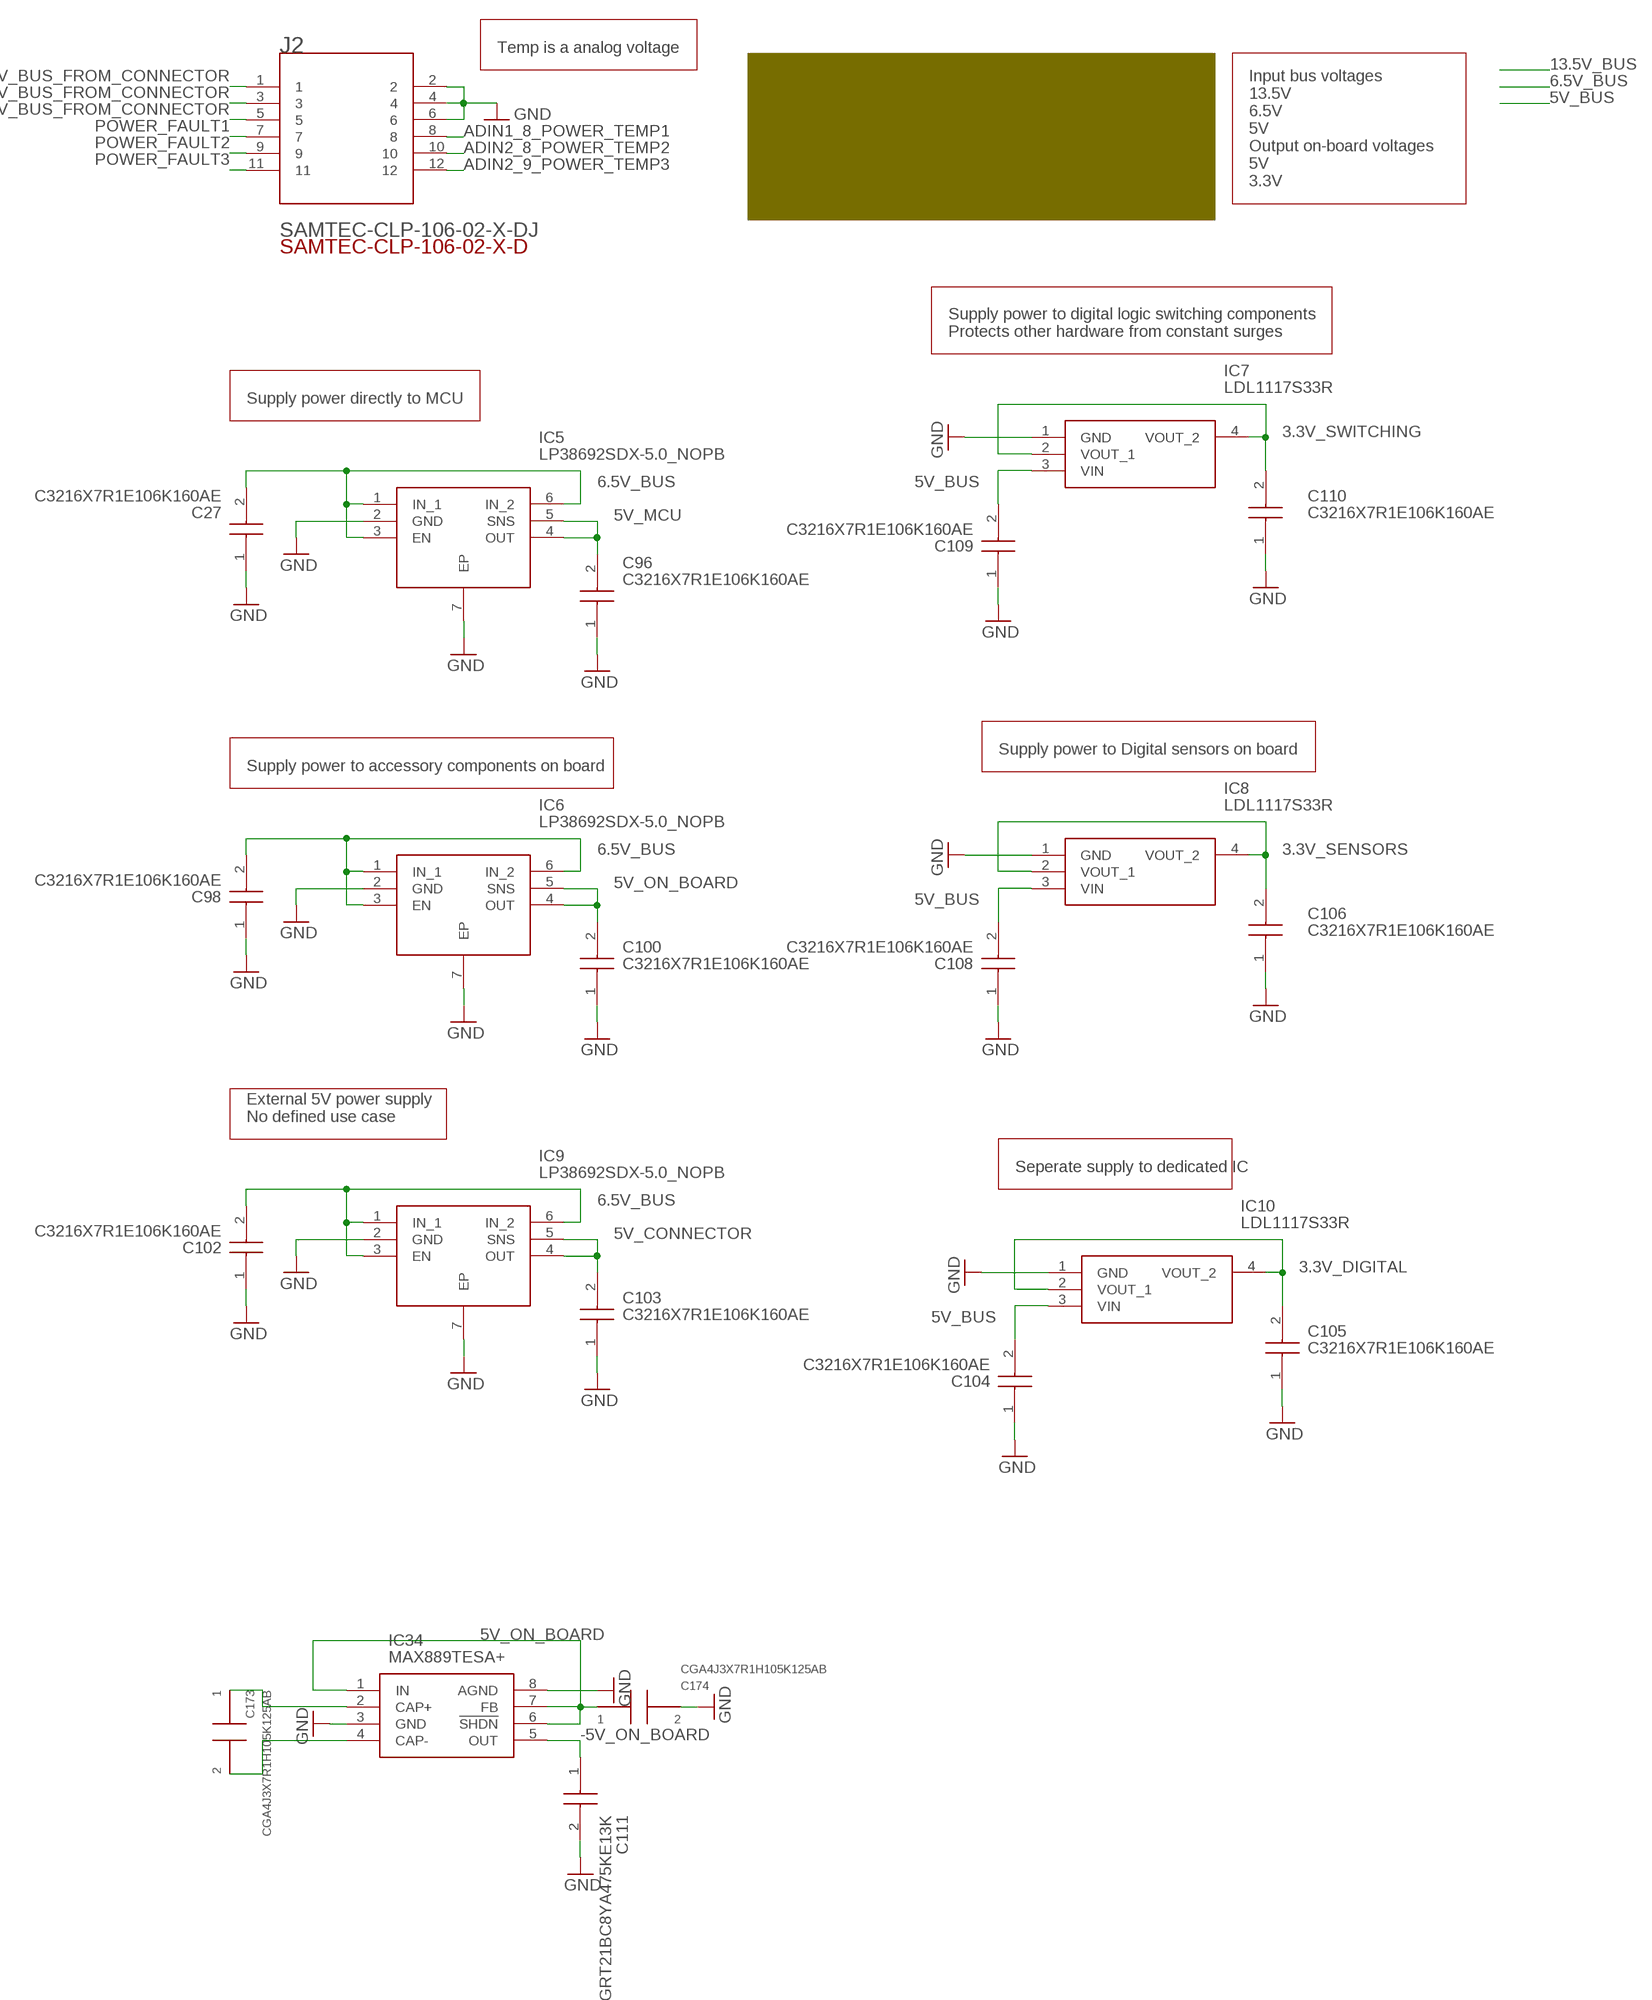
[diagram p6: schematic, sheet 4]

### Parts
C27  C3216X7R1E106K160AE  [C3216_COMMERCIAL]
C96  C3216X7R1E106K160AE  [C3216_COMMERCIAL]
C98  C3216X7R1E106K160AE  [C3216_COMMERCIAL]
C100  C3216X7R1E106K160AE  [C3216_COMMERCIAL]
C102  C3216X7R1E106K160AE  [C3216_COMMERCIAL]
C103  C3216X7R1E106K160AE  [C3216_COMMERCIAL]
C104  C3216X7R1E106K160AE  [C3216_COMMERCIAL]
C105  C3216X7R1E106K160AE  [C3216_COMMERCIAL]
C106  C3216X7R1E106K160AE  [C3216_COMMERCIAL]
C108  C3216X7R1E106K160AE  [C3216_COMMERCIAL]
C109  C3216X7R1E106K160AE  [C3216_COMMERCIAL]
C110  C3216X7R1E106K160AE  [C3216_COMMERCIAL]
C111  GRT21BC8YA475KE13K  [CAPC2012X135N]
C173  CGA4J3X7R1H105K125AB  [CAPC2012X145N]
C174  CGA4J3X7R1H105K125AB  [CAPC2012X145N]
IC5  LP38692SDX-5.0_NOPB  [SON95P300X300X80-7N]
IC6  LP38692SDX-5.0_NOPB  [SON95P300X300X80-7N]
IC7  LDL1117S33R  [SOT230P700X180-4N]
IC8  LDL1117S33R  [SOT230P700X180-4N]
IC9  LP38692SDX-5.0_NOPB  [SON95P300X300X80-7N]
IC10  LDL1117S33R  [SOT230P700X180-4N]
IC34  MAX889TESA+  [SOIC127P600X175-8N]
J2  SAMTEC-CLP-106-02-X-DJ  [SAMTEC-CLP-106-02-X-D]

### Nets
3.3V_DIGITAL: C105.2 IC10.2(VOUT_1) IC10.4(VOUT_2) ; also sheet 1,2,9,10,11
3.3V_SENSORS: C106.2 IC8.2(VOUT_1) IC8.4(VOUT_2) ; also sheet 7,8,9
3.3V_SWITCHING: C110.2 IC7.2(VOUT_1) IC7.4(VOUT_2) ; also sheet 3,12
5V_BUS: C104.2 C108.2 C109.2 IC7.3(VIN) IC8.3(VIN) IC10.3(VIN) ; also sheet 5
5V_BUS_FROM_CONNECTOR: J2.5 ; also sheet 5
5V_CONNECTOR: C103.2 IC9.4(OUT) IC9.5(SNS) ; also sheet 12
5V_MCU: C96.2 IC5.4(OUT) IC5.5(SNS) ; also sheet 12
5V_ON_BOARD: C100.2 C174.1 IC6.4(OUT) IC6.5(SNS) IC34.1(IN) IC34.6(!SHDN) IC34.7(FB) ; also sheet 1,2,6
6.5V_BUS: C27.2 C98.2 C102.2 IC5.1(IN_1) IC5.3(EN) IC5.6(IN_2) IC6.1(IN_1) IC6.3(EN) IC6.6(IN_2) IC9.1(IN_1) IC9.3(EN) IC9.6(IN_2) ; also sheet 5
6.5V_BUS_FROM_CONNECTOR: J2.3 ; also sheet 5
14V_BUS_FROM_CONNECTOR: J2.1 ; also sheet 5
-5V_ON_BOARD: C111.1 IC34.5(OUT) ; also sheet 1,2
ADIN1_8_POWER_TEMP1: J2.8 ; also sheet 11
ADIN2_8_POWER_TEMP2: J2.10 ; also sheet 11
ADIN2_9_POWER_TEMP3: J2.12 ; also sheet 11
GND: C27.1 C96.1 C98.1 C100.1 C102.1 C103.1 C104.1 C105.1 C106.1 C108.1 C109.1 C110.1 C111.2 C174.2 IC5.2(GND) IC5.7(EP) IC6.2(GND) IC6.7(EP) IC7.1(GND) IC8.1(GND) IC9.2(GND) IC9.7(EP) IC10.1(GND) IC34.3(GND) IC34.8(AGND) J2.2 J2.4 J2.6 ; also sheet 1,2,3,5,6,7,8,9,10,11,12
N$81: C173.1 IC34.2(CAP+)
N$82: C173.2 IC34.4(CAP-)
POWER_FAULT1: J2.7 ; also sheet 12
POWER_FAULT2: J2.9 ; also sheet 12
POWER_FAULT3: J2.11 ; also sheet 12

### Notes on the sheet
- Temp is a analog voltage
- Input bus voltages
  13.5V
  6.5V
  5V
  Output on-board voltages 
  5V
  3.3V
- Power rails
  
  -12V 
  -5V Dedicated to microcontroller and gps only
  -5V Dedicated to strain gauge configurations and hardware
  -5V Dedicated to general purpose sensors
  -3.3V Dedicated to basic digital logic
  -3.3V Dedicated to General sensors.
- Supply power to digital logic switching components
  Protects other hardware from constant surges
- Supply power directly to MCU
- Supply power to Digital sensors on board
- Supply power to accessory components on board
- External 5V power supply
  No defined use case
- Seperate supply to dedicated IC

## Sheet 5 of 12: Current measurements
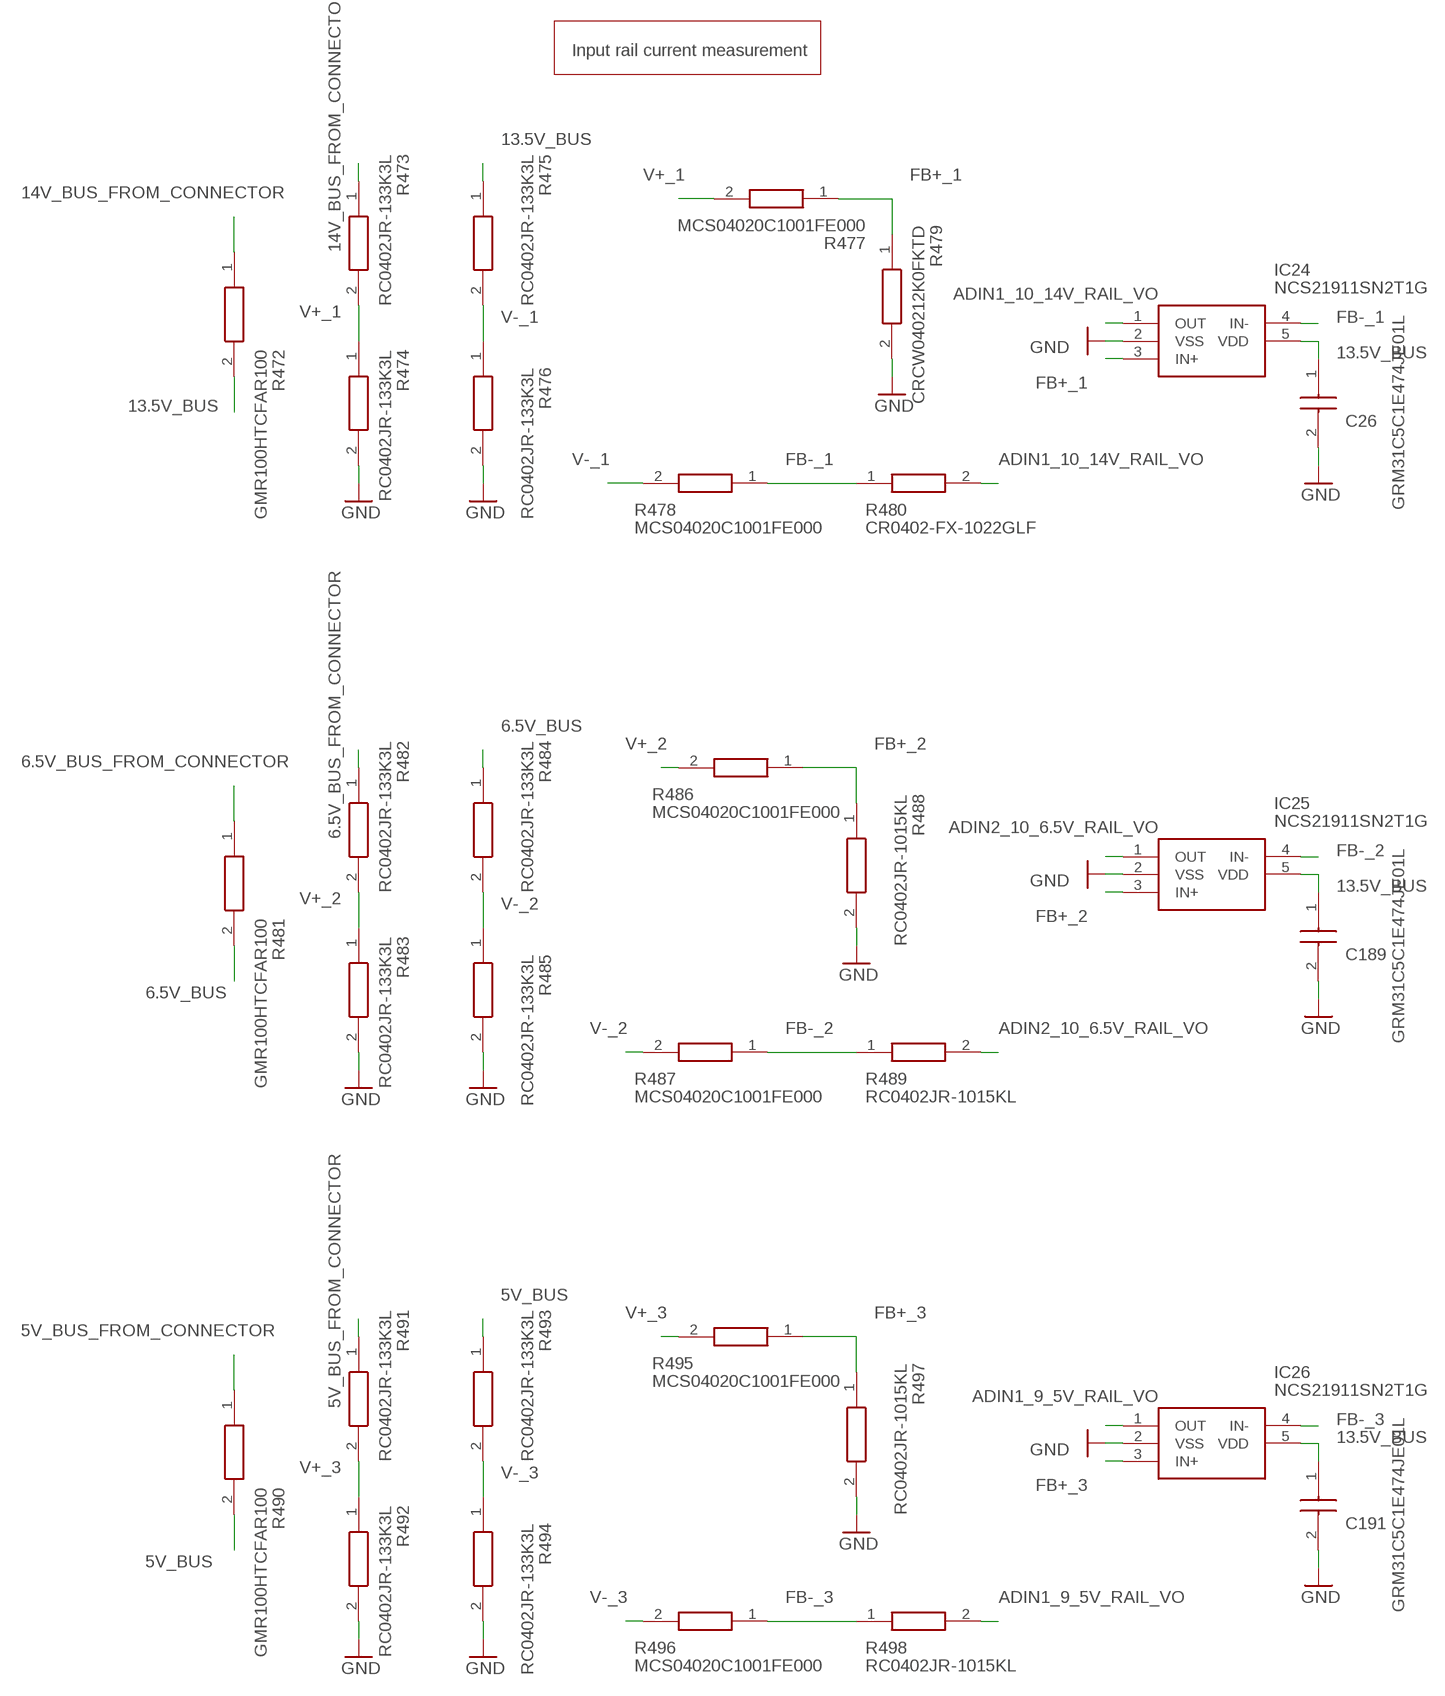
[diagram p7: schematic, sheet 5]

### Parts
C26  GRM31C5C1E474JE01L  [CAPC3216X180N]
C189  GRM31C5C1E474JE01L  [CAPC3216X180N]
C191  GRM31C5C1E474JE01L  [CAPC3216X180N]
IC24  NCS21911SN2T1G  [SOT95P275X110-5N]
IC25  NCS21911SN2T1G  [SOT95P275X110-5N]
IC26  NCS21911SN2T1G  [SOT95P275X110-5N]
R472  GMR100HTCFAR100  [RESC6432X55N]
R473  RC0402JR-133K3L  [RESC1005X40N]
R474  RC0402JR-133K3L  [RESC1005X40N]
R475  RC0402JR-133K3L  [RESC1005X40N]
R476  RC0402JR-133K3L  [RESC1005X40N]
R477  MCS04020C1001FE000  [RESC1005X37N]
R478  MCS04020C1001FE000  [RESC1005X37N]
R479  CRCW040212K0FKTD  [RESC1005X40N]
R480  CR0402-FX-1022GLF  [RESC1005X40N]
R481  GMR100HTCFAR100  [RESC6432X55N]
R482  RC0402JR-133K3L  [RESC1005X40N]
R483  RC0402JR-133K3L  [RESC1005X40N]
R484  RC0402JR-133K3L  [RESC1005X40N]
R485  RC0402JR-133K3L  [RESC1005X40N]
R486  MCS04020C1001FE000  [RESC1005X37N]
R487  MCS04020C1001FE000  [RESC1005X37N]
R488  RC0402JR-1015KL  [RESC1005X40N]
R489  RC0402JR-1015KL  [RESC1005X40N]
R490  GMR100HTCFAR100  [RESC6432X55N]
R491  RC0402JR-133K3L  [RESC1005X40N]
R492  RC0402JR-133K3L  [RESC1005X40N]
R493  RC0402JR-133K3L  [RESC1005X40N]
R494  RC0402JR-133K3L  [RESC1005X40N]
R495  MCS04020C1001FE000  [RESC1005X37N]
R496  MCS04020C1001FE000  [RESC1005X37N]
R497  RC0402JR-1015KL  [RESC1005X40N]
R498  RC0402JR-1015KL  [RESC1005X40N]

### Nets
5V_BUS: R490.2 R493.1 ; also sheet 4
5V_BUS_FROM_CONNECTOR: R490.1 R491.1 ; also sheet 4
6.5V_BUS: R481.2 R484.1 ; also sheet 4
6.5V_BUS_FROM_CONNECTOR: R481.1 R482.1 ; also sheet 4
13.5V_BUS: C26.1 C189.1 C191.1 IC24.5(VDD) IC25.5(VDD) IC26.5(VDD) R472.2 R475.1 ; also sheet 2,4,6,11,12
14V_BUS_FROM_CONNECTOR: R472.1 R473.1 ; also sheet 4
ADIN1_9_5V_RAIL_VO: IC26.1(OUT) R498.2 ; also sheet 11
ADIN1_10_14V_RAIL_VO: IC24.1(OUT) R480.2 ; also sheet 11
ADIN2_10_6.5V_RAIL_VO: IC25.1(OUT) R489.2 ; also sheet 11
FB+_1: IC24.3(IN+) R477.1 R479.1
FB+_2: IC25.3(IN+) R486.1 R488.1
FB+_3: IC26.3(IN+) R495.1 R497.1
FB-_1: IC24.4(IN-) R478.1 R480.1
FB-_2: IC25.4(IN-) R487.1 R489.1
FB-_3: IC26.4(IN-) R496.1 R498.1
GND: C26.2 C189.2 C191.2 IC24.2(VSS) IC25.2(VSS) IC26.2(VSS) R474.2 R476.2 R479.2 R483.2 R485.2 R488.2 R492.2 R494.2 R497.2 ; also sheet 1,2,3,4,6,7,8,9,10,11,12
V+_1: R473.2 R474.1 R477.2
V+_2: R482.2 R483.1 R486.2
V+_3: R491.2 R492.1 R495.2
V-_1: R475.2 R476.1 R478.2
V-_2: R484.2 R485.1 R487.2
V-_3: R493.2 R494.1 R496.2

### Notes on the sheet
- Input rail current measurement

## Sheet 6 of 12: Temperature sensors
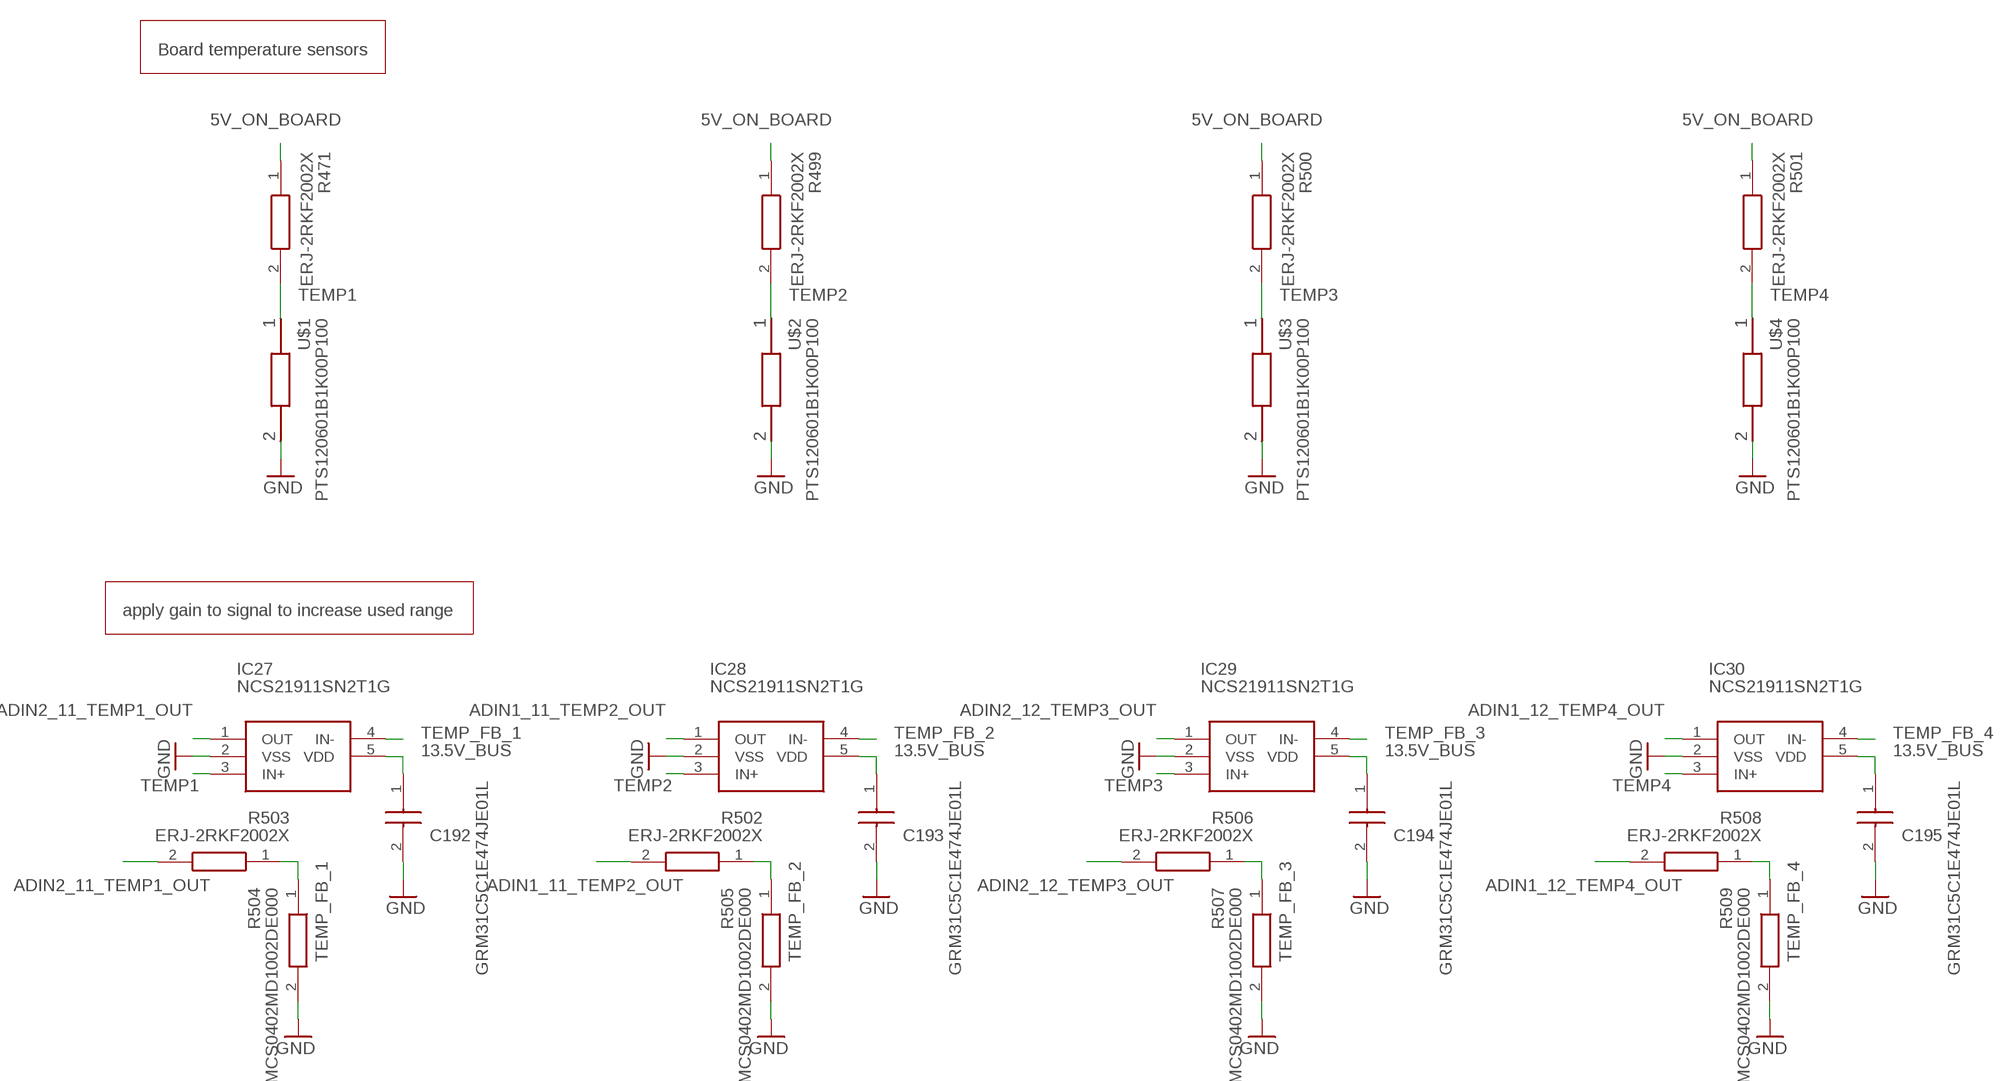
[diagram p8: schematic, sheet 6]

### Parts
C192  GRM31C5C1E474JE01L  [CAPC3216X180N]
C193  GRM31C5C1E474JE01L  [CAPC3216X180N]
C194  GRM31C5C1E474JE01L  [CAPC3216X180N]
C195  GRM31C5C1E474JE01L  [CAPC3216X180N]
IC27  NCS21911SN2T1G  [SOT95P275X110-5N]
IC28  NCS21911SN2T1G  [SOT95P275X110-5N]
IC29  NCS21911SN2T1G  [SOT95P275X110-5N]
IC30  NCS21911SN2T1G  [SOT95P275X110-5N]
R471  ERJ-2RKF2002X  [ERJ2R_(0402)]
R499  ERJ-2RKF2002X  [ERJ2R_(0402)]
R500  ERJ-2RKF2002X  [ERJ2R_(0402)]
R501  ERJ-2RKF2002X  [ERJ2R_(0402)]
R502  ERJ-2RKF2002X  [ERJ2R_(0402)]
R503  ERJ-2RKF2002X  [ERJ2R_(0402)]
R504  MCS0402MD1002DE000  [RESC1005X37N]
R505  MCS0402MD1002DE000  [RESC1005X37N]
R506  ERJ-2RKF2002X  [ERJ2R_(0402)]
R507  MCS0402MD1002DE000  [RESC1005X37N]
R508  ERJ-2RKF2002X  [ERJ2R_(0402)]
R509  MCS0402MD1002DE000  [RESC1005X37N]
U$1  PTS120601B1K00P100  [RESC3016X70N]
U$2  PTS120601B1K00P100  [RESC3016X70N]
U$3  PTS120601B1K00P100  [RESC3016X70N]
U$4  PTS120601B1K00P100  [RESC3016X70N]

### Nets
5V_ON_BOARD: R471.1 R499.1 R500.1 R501.1 ; also sheet 1,2,4
13.5V_BUS: C192.1 C193.1 C194.1 C195.1 IC27.5(VDD) IC28.5(VDD) IC29.5(VDD) IC30.5(VDD) ; also sheet 2,4,5,11,12
ADIN1_11_TEMP2_OUT: IC28.1(OUT) R502.2 ; also sheet 11
ADIN1_12_TEMP4_OUT: IC30.1(OUT) R508.2 ; also sheet 11
ADIN2_11_TEMP1_OUT: IC27.1(OUT) R503.2 ; also sheet 11
ADIN2_12_TEMP3_OUT: IC29.1(OUT) R506.2 ; also sheet 11
GND: C192.2 C193.2 C194.2 C195.2 IC27.2(VSS) IC28.2(VSS) IC29.2(VSS) IC30.2(VSS) R504.2 R505.2 R507.2 R509.2 U$1.2 U$2.2 U$3.2 U$4.2 ; also sheet 1,2,3,4,5,7,8,9,10,11,12
TEMP1: IC27.3(IN+) R471.2 U$1.1
TEMP2: IC28.3(IN+) R499.2 U$2.1
TEMP3: IC29.3(IN+) R500.2 U$3.1
TEMP4: IC30.3(IN+) R501.2 U$4.1
TEMP_FB_1: IC27.4(IN-) R503.1 R504.1
TEMP_FB_2: IC28.4(IN-) R502.1 R505.1
TEMP_FB_3: IC29.4(IN-) R506.1 R507.1
TEMP_FB_4: IC30.4(IN-) R508.1 R509.1

### Notes on the sheet
- Board temperature sensors
- apply gain to signal to increase used range

## Sheet 7 of 12: GPS
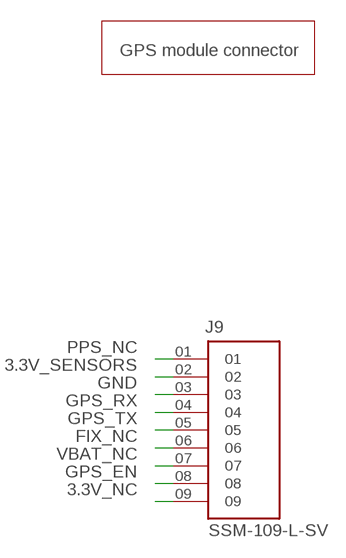
[diagram p9: schematic, sheet 7]

### Parts
J9  SSM-109-L-SV  [SAMTEC_SSM-109-L-SV]

### Nets
3.3V_NC: J9.09
3.3V_SENSORS: J9.02 ; also sheet 4,8,9
FIX_NC: J9.06
GND: J9.03 ; also sheet 1,2,3,4,5,6,8,9,10,11,12
GPS_EN: J9.08 ; also sheet 12
GPS_RX: J9.04 ; also sheet 12
GPS_TX: J9.05 ; also sheet 12
PPS_NC: J9.01
VBAT_NC: J9.07

### Notes on the sheet
- GPS module connector

## Sheet 8 of 12: IMU
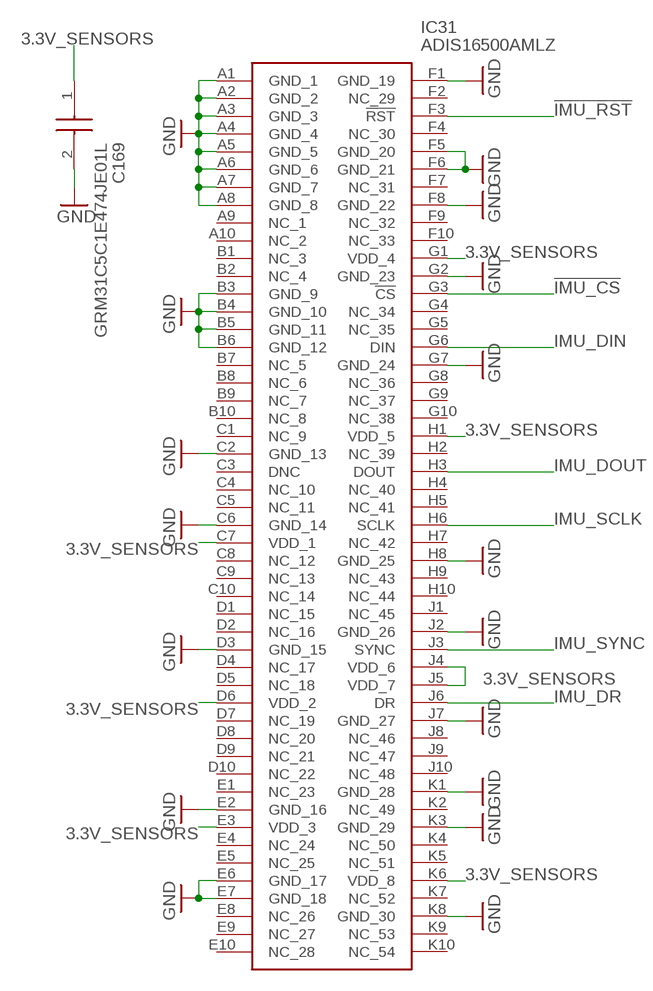
[diagram p10: schematic, sheet 8]

### Parts
C169  GRM31C5C1E474JE01L  [CAPC3216X180N]
IC31  ADIS16500AMLZ  [BGA100C127P10X10_1500X1500X608]

### Nets
3.3V_SENSORS: C169.1 IC31.C7(VDD_1) IC31.D6(VDD_2) IC31.E3(VDD_3) IC31.G1(VDD_4) IC31.H1(VDD_5) IC31.J4(VDD_6) IC31.J5(VDD_7) IC31.K6(VDD_8) ; also sheet 4,7,9
!IMU_CS: IC31.G3(!CS) ; also sheet 12
!IMU_RST: IC31.F3(!RST) ; also sheet 12
GND: C169.2 IC31.A1(GND_1) IC31.A2(GND_2) IC31.A3(GND_3) IC31.A4(GND_4) IC31.A5(GND_5) IC31.A6(GND_6) IC31.A7(GND_7) IC31.A8(GND_8) IC31.B3(GND_9) IC31.B4(GND_10) IC31.B5(GND_11) IC31.B6(GND_12) IC31.C2(GND_13) IC31.C6(GND_14) IC31.D3(GND_15) IC31.E2(GND_16) IC31.E6(GND_17) IC31.E7(GND_18) IC31.F1(GND_19) IC31.F5(GND_20) IC31.F6(GND_21) IC31.F8(GND_22) IC31.G2(GND_23) IC31.G7(GND_24) IC31.H8(GND_25) IC31.J2(GND_26) IC31.J7(GND_27) IC31.K1(GND_28) IC31.K3(GND_29) IC31.K8(GND_30) ; also sheet 1,2,3,4,5,6,7,9,10,11,12
IMU_DIN: IC31.G6(DIN) ; also sheet 12
IMU_DOUT: IC31.H3(DOUT) ; also sheet 12
IMU_DR: IC31.J6(DR) ; also sheet 12
IMU_SCLK: IC31.H6(SCLK) ; also sheet 12
IMU_SYNC: IC31.J3(SYNC) ; also sheet 12
Unconnected: IC31.A9(NC_1) IC31.A10(NC_2) IC31.B1(NC_3) IC31.B2(NC_4) IC31.B7(NC_5) IC31.B8(NC_6) IC31.B9(NC_7) IC31.B10(NC_8) IC31.C1(NC_9) IC31.C3(DNC) IC31.C4(NC_10) IC31.C5(NC_11) IC31.C8(NC_12) IC31.C9(NC_13) IC31.C10(NC_14) IC31.D1(NC_15) IC31.D2(NC_16) IC31.D4(NC_17) IC31.D5(NC_18) IC31.D7(NC_19) IC31.D8(NC_20) IC31.D9(NC_21) IC31.D10(NC_22) IC31.E1(NC_23) IC31.E4(NC_24) IC31.E5(NC_25) IC31.E8(NC_26) IC31.E9(NC_27) IC31.E10(NC_28) IC31.F2(NC_29) IC31.F4(NC_30) IC31.F7(NC_31) IC31.F9(NC_32) IC31.F10(NC_33) IC31.G4(NC_34) IC31.G5(NC_35) IC31.G8(NC_36) IC31.G9(NC_37) IC31.G10(NC_38) IC31.H2(NC_39) IC31.H4(NC_40) IC31.H5(NC_41) IC31.H7(NC_42) IC31.H9(NC_43) IC31.H10(NC_44) IC31.J1(NC_45) IC31.J8(NC_46) IC31.J9(NC_47) IC31.J10(NC_48) IC31.K2(NC_49) IC31.K4(NC_50) IC31.K5(NC_51) IC31.K7(NC_52) IC31.K9(NC_53) IC31.K10(NC_54)

## Sheet 9 of 12: ISO SPI LINK
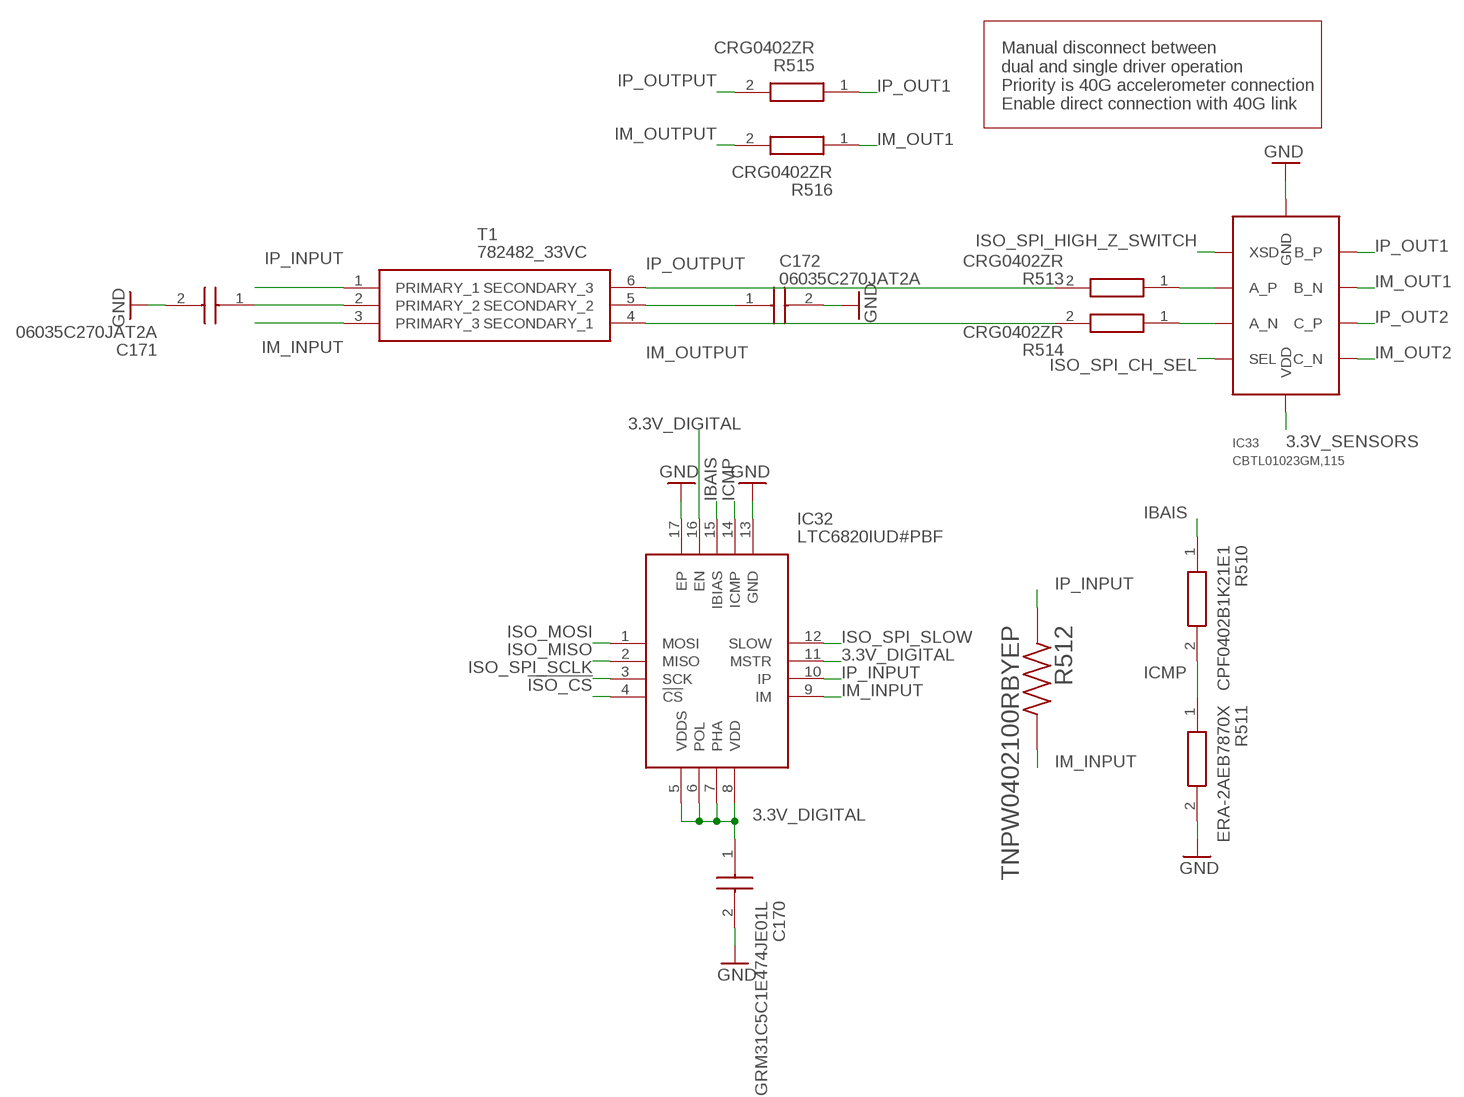
[diagram p11: schematic, sheet 9]

### Parts
C170  GRM31C5C1E474JE01L  [CAPC3216X180N]
C171  06035C270JAT2A  [CAPC1608X90N]
C172  06035C270JAT2A  [CAPC1608X90N]
IC32  LTC6820IUD#PBF  [QFN50P300X300X80-17N]
IC33  CBTL01023GM,115  [QFN50P200X155X50-10N]
R510  CPF0402B1K21E1  [RESC1005X35N]
R511  ERA-2AEB7870X  [ERA2AED122X]
R512  TNPW0402100RBYEP  [RESC1005X40N]
R513  CRG0402ZR  [RESC1005X40N]
R514  CRG0402ZR  [RESC1005X40N]
R515  CRG0402ZR  [RESC1005X40N]
R516  CRG0402ZR  [RESC1005X40N]
T1  782482_33VC  [DIP1016W60P254L914H635Q6N]

### Nets
3.3V_DIGITAL: C170.1 IC32.5(VDDS) IC32.6(POL) IC32.7(PHA) IC32.8(VDD) IC32.11(MSTR) IC32.16(EN) ; also sheet 1,2,4,10,11
3.3V_SENSORS: IC33.5(VDD) ; also sheet 4,7,8
!ISO_CS: IC32.4(!CS) ; also sheet 12
GND: C170.2 C171.2 C172.2 IC32.13(GND) IC32.17(EP) IC33.10(GND) R511.2 ; also sheet 1,2,3,4,5,6,7,8,10,11,12
IBAIS: IC32.15(IBIAS) R510.1
ICMP: IC32.14(ICMP) R510.2 R511.1
IM_INPUT: IC32.9(IM) R512.2 T1.3(PRIMARY_3)
IM_OUT1: IC33.8(B_N) R516.1 ; also sheet 11
IM_OUT2: IC33.6(C_N) ; also sheet 11
IM_OUTPUT: R514.2 R516.2 T1.4(SECONDARY_1)
IP_INPUT: IC32.10(IP) R512.1 T1.1(PRIMARY_1)
IP_OUT1: IC33.9(B_P) R515.1 ; also sheet 11
IP_OUT2: IC33.7(C_P) ; also sheet 11
IP_OUTPUT: R513.2 R515.2 T1.6(SECONDARY_3)
ISO_MISO: IC32.2(MISO) ; also sheet 12
ISO_MOSI: IC32.1(MOSI) ; also sheet 12
ISO_SPI_CH_SEL: IC33.4(SEL) ; also sheet 12
ISO_SPI_HIGH_Z_SWITCH: IC33.1(XSD) ; also sheet 12
ISO_SPI_SCLK: IC32.3(SCK) ; also sheet 12
ISO_SPI_SLOW: IC32.12(SLOW) ; also sheet 12
N$345: IC33.2(A_P) R513.1
N$347: IC33.3(A_N) R514.1
N$356: C171.1 T1.2(PRIMARY_2)
N$360: C172.1 T1.5(SECONDARY_2)

### Notes on the sheet
- Manual disconnect between 
  dual and single driver operation
  Priority is 40G accelerometer connection
  Enable direct connection with 40G link

## Sheet 10 of 12: Memory / Storage
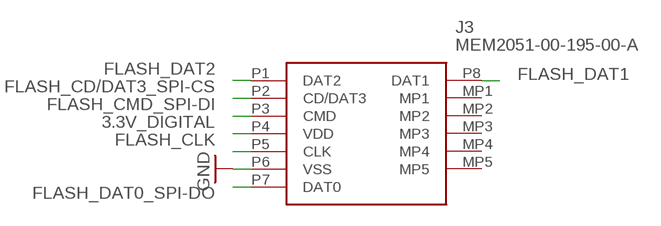
[diagram p12: schematic, sheet 10]

### Parts
J3  MEM2051-00-195-00-A  [MEM20510019500A]

### Nets
3.3V_DIGITAL: J3.P4(VDD) ; also sheet 1,2,4,9,11
FLASH_CD/DAT3_SPI-CS: J3.P2(CD/DAT3) ; also sheet 12
FLASH_CLK: J3.P5(CLK) ; also sheet 12
FLASH_CMD_SPI-DI: J3.P3(CMD) ; also sheet 12
FLASH_DAT0_SPI-DO: J3.P7(DAT0) ; also sheet 12
FLASH_DAT1: J3.P8(DAT1) ; also sheet 12
FLASH_DAT2: J3.P1(DAT2) ; also sheet 12
GND: J3.P6(VSS) ; also sheet 1,2,3,4,5,6,7,8,9,11,12
Unconnected: J3.MP1 J3.MP2 J3.MP3 J3.MP4 J3.MP5